# Altium project CM4-Tower.PrjPcb (part 3 of 4)

## Sheet 06_USB_Type-C_DFP.SchDoc: USB-C Connectors
size A2; Organization: Greenfield Tech Solutions; Address1: Molendreef 33; Address2: Ossendrecht; Address3: 4641CS; Address4: The Netherlands; Revision: 1.1; SheetNumber: 6; SheetTotal: 11
Used 2 times, as channels USB_Type-C_DFP_0, USB_Type-C_DFP_1. Parts and nets are listed once, with the designators drawn on the sheet.
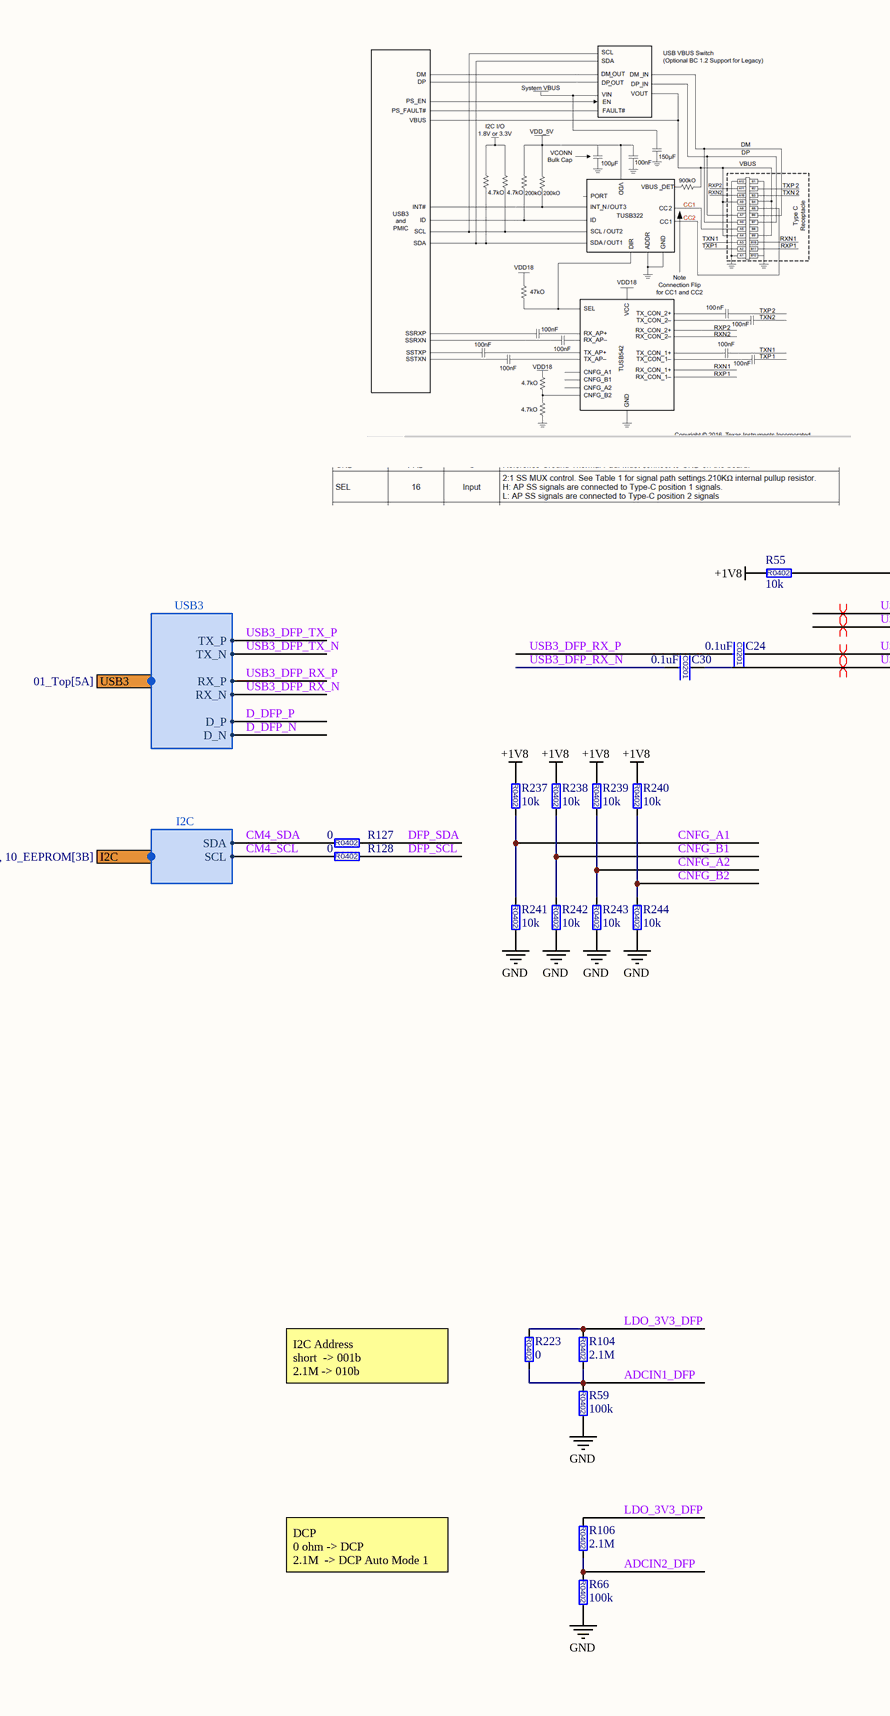
[diagram p6: 06_USB_Type-C_DFP.SchDoc, left]
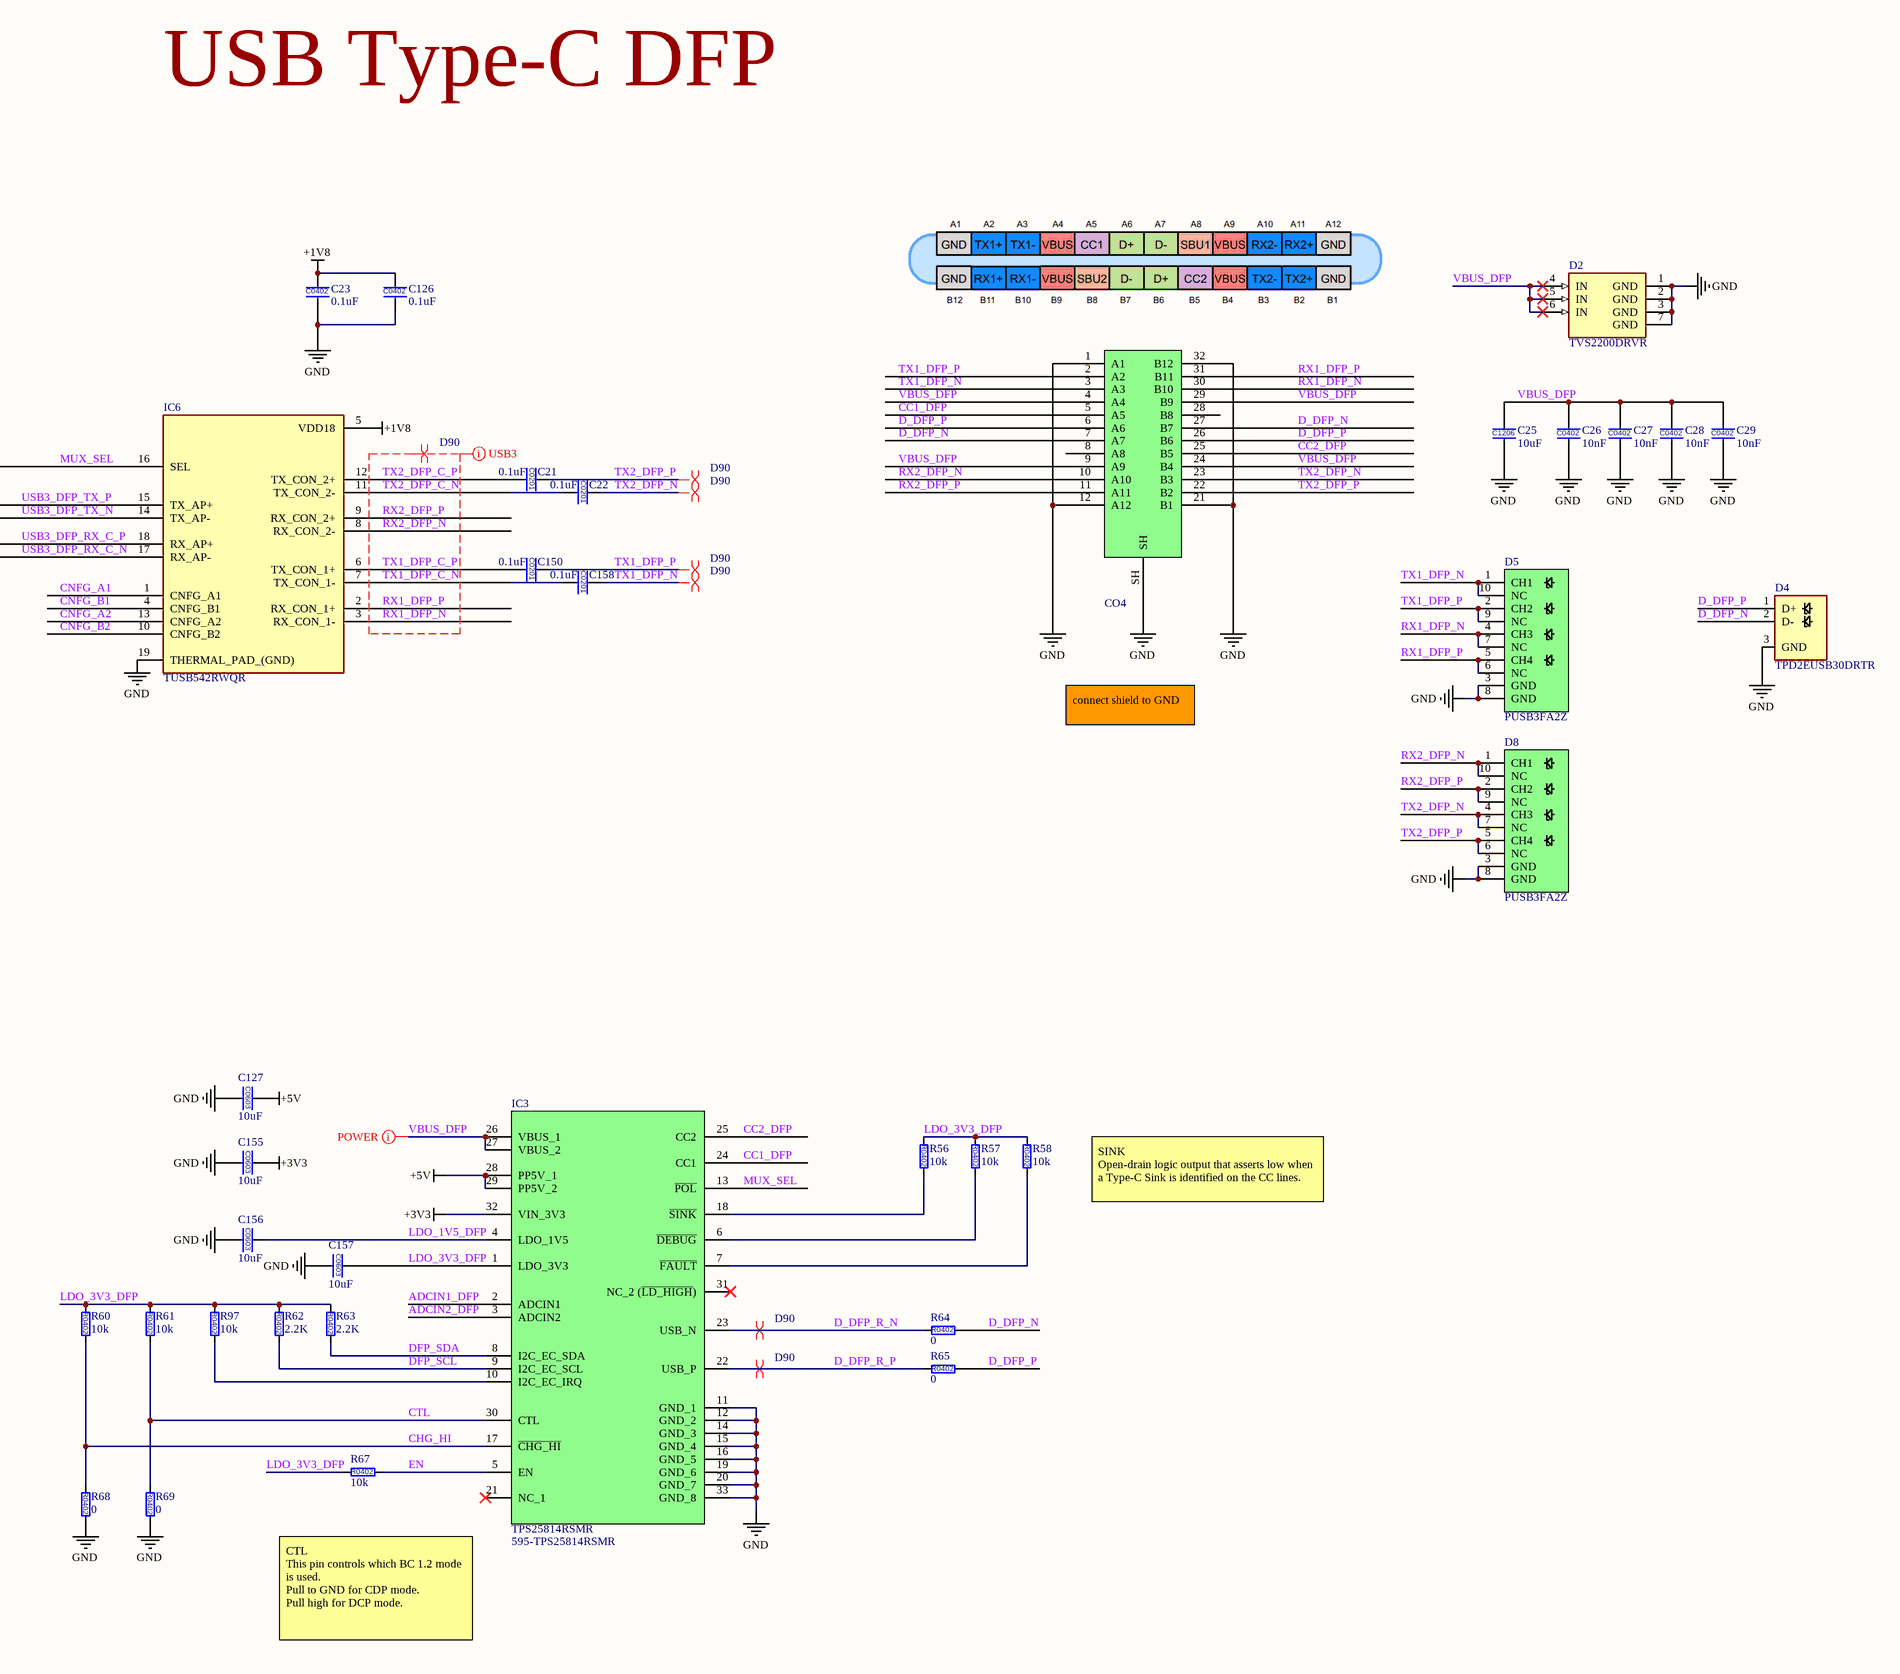
[diagram p7: 06_USB_Type-C_DFP.SchDoc, right]

### Parts
C21  0.1uF  [C0201]
C22  0.1uF  [C0201]
C23  0.1uF  [C0402]
C24  0.1uF  [C0201]
C25  10uF  [C1206]
C26  10nF  [C0402]
C27  10nF  [C0402]
C28  10nF  [C0402]
C29  10nF  [C0402]
C30  0.1uF  [C0201]
C126  0.1uF  [C0402]
C127  10uF  [C0603]
C150  0.1uF  [C0201]
C155  10uF  [C0603]
C156  10uF  [C0603]
C157  10uF  [C0603]
C158  0.1uF  [C0201]
CO4  USB4070-30-C  [USB4070-30-C]  (value not drawn)
D2  TVS2200DRVR  [TVS2200D_SON_6]
D4  TPD2EUSB30DRTR  [TPD2EUSB30DRTR_SOT-3]
D5  PUSB3FA2Z  [PUSB3FA2Z_DFN_2510_10]
D8  PUSB3FA2Z  [PUSB3FA2Z_DFN_2510_10]
IC3  TPS25814RSMR  Supplier Part Number 1: 595-TPS25814RSMR  [TPS25814RSMR_VQFN_32]
IC6  TUSB542RWQR  [TUSB542_X2QFN_18]
R55  10k  [R0402]
R56  10k  [R0402]
R57  10k  [R0402]
R58  10k  [R0402]
R59  100k  [R0402]
R60  10k  [R0402]
R61  10k  [R0402]
R62  2.2K  [R0402]
R63  2.2K  [R0402]
R64  0  [R0402]
R65  0  [R0402]
R66  100k  [R0402]
R67  10k  [R0402]
R68  0  [R0402]
R69  0  [R0402]
R97  10k  [R0402]
R104  2.1M  [R0402]
R106  2.1M  [R0402]
R127  0  [R0402]
R128  0  [R0402]
R223  0  [R0402]
R237  10k  [R0402]
R238  10k  [R0402]
R239  10k  [R0402]
R240  10k  [R0402]
R241  10k  [R0402]
R242  10k  [R0402]
R243  10k  [R0402]
R244  10k  [R0402]

### Ports
I2C (harness I2C, see 01_Top[4A], 03_RPiCM4[1B], 05_HDMI_to_DP[1B], 07_USB_Type-C_DFP_DP_ALT[1B], 08_USB_Type-C_DFP_DP_ALT_buttom[1B], 09_RTC[3B], 10_EEPROM[3B]), USB3 (harness USB3, see 01_Top[5A])

### Harnesses
USB3: TX_P, TX_N, RX_P, RX_N, D_P, D_N
I2C: SDA, SCL

### Nets
+1V8: C23.1 C126.1 IC6.5(VDD18) R55.1 R237.1 R238.1 R239.1 R240.1
+3V3: C155.1 IC3.32(VIN_3V3)
+5V: C127.1 IC3.28(PP5V_1) IC3.29(PP5V_2)
GND: C23.2 C25.2 C26.2 C27.2 C28.2 C29.2 C126.2 C127.2 C155.2 C156.2 C157.2 CO4.1(A1) CO4.12(A12) CO4.21(B1) CO4.32(B12) CO4.SH D2.1(GND) D2.2(GND) D2.3(GND) D2.7(GND) D4.3(GND) D5.3(GND) D5.8(GND) D8.3(GND) D8.8(GND) IC3.11(GND_1) IC3.12(GND_2) IC3.14(GND_3) IC3.15(GND_4) IC3.16(GND_5) IC3.19(GND_6) IC3.20(GND_7) IC3.33(GND_8) IC6.19(THERMAL_PAD_(GND)) R59.2 R66.2 R68.2 R69.2 R241.2 R242.2 R243.2 R244.2
ADCIN1_DFP: IC3.2(ADCIN1) R59.1 R104.2 R223.2
ADCIN2_DFP: IC3.3(ADCIN2) R66.1 R106.2
CC1_DFP: CO4.5(A5) IC3.24(CC1)
CC2_DFP: CO4.25(B5) IC3.25(CC2)
CHG_HI: IC3.17(~{CHG_HI}) R60.2 R68.1
CM4_SCL: R128.1 ; port I2C.SCL
CM4_SDA: R127.1 ; port I2C.SDA
CNFG_A1: IC6.1(CNFG_A1) R237.2 R241.1
CNFG_A2: IC6.13(CNFG_A2) R239.2 R243.1
CNFG_B1: IC6.4(CNFG_B1) R238.2 R242.1
CNFG_B2: IC6.10(CNFG_B2) R240.2 R244.1
CTL: IC3.30(CTL) R61.2 R69.1
D_DFP_N: CO4.7(A7) CO4.27(B7) D4.2(D-) R64.2 ; port USB3.D_N
D_DFP_P: CO4.6(A6) CO4.26(B6) D4.1(D+) R65.2 ; port USB3.D_P
D_DFP_R_N: IC3.23(USB_N) R64.1
D_DFP_R_P: IC3.22(USB_P) R65.1
DFP_SCL: IC3.9(I2C_EC_SCL) R62.2 R128.2
DFP_SDA: IC3.8(I2C_EC_SDA) R63.2 R127.2
EN: IC3.5(EN) R67.2
LDO_1V5_DFP: C156.1 IC3.4(LDO_1V5)
LDO_3V3_DFP: C157.1 IC3.1(LDO_3V3) R56.1 R57.1 R58.1 R60.1 R61.1 R62.1 R63.1 R67.1 R97.1 R104.1 R106.1 R223.1
MUX_SEL: IC3.13(~{POL}) IC6.16(SEL) R55.2
RX1_DFP_N: CO4.30(B10) D5.4(CH3) D5.7(NC) IC6.3(RX_CON_1-)
RX1_DFP_P: CO4.31(B11) D5.5(CH4) D5.6(NC) IC6.2(RX_CON_1+)
RX2_DFP_N: CO4.10(A10) D8.1(CH1) D8.10(NC) IC6.8(RX_CON_2-)
RX2_DFP_P: CO4.11(A11) D8.2(CH2) D8.9(NC) IC6.9(RX_CON_2+)
TX1_DFP_C_N: C158.2 IC6.7(TX_CON_1-)
TX1_DFP_C_P: C150.2 IC6.6(TX_CON_1+)
TX1_DFP_N: C158.1 CO4.3(A3) D5.1(CH1) D5.10(NC)
TX1_DFP_P: C150.1 CO4.2(A2) D5.2(CH2) D5.9(NC)
TX2_DFP_C_N: C22.2 IC6.11(TX_CON_2-)
TX2_DFP_C_P: C21.2 IC6.12(TX_CON_2+)
TX2_DFP_N: C22.1 CO4.23(B3) D8.4(CH3) D8.7(NC)
TX2_DFP_P: C21.1 CO4.22(B2) D8.5(CH4) D8.6(NC)
USB3_DFP_RX_C_N: C30.1 IC6.17(RX_AP-)
USB3_DFP_RX_C_P: C24.1 IC6.18(RX_AP+)
USB3_DFP_RX_N: C30.2 ; port USB3.RX_N
USB3_DFP_RX_P: C24.2 ; port USB3.RX_P
USB3_DFP_TX_N: IC6.14(TX_AP-) ; port USB3.TX_N
USB3_DFP_TX_P: IC6.15(TX_AP+) ; port USB3.TX_P
VBUS_DFP: C25.1 C26.1 C27.1 C28.1 C29.1 CO4.4(A4) CO4.9(A9) CO4.24(B4) CO4.29(B9) D2.4(IN) D2.5(IN) D2.6(IN) IC3.26(VBUS_1) IC3.27(VBUS_2)
NetIC3_6: IC3.6(~{DEBUG}) R57.2
NetIC3_7: IC3.7(~{FAULT}) R58.2
NetIC3_10: IC3.10(I2C_EC_IRQ) R97.2
NetIC3_18: IC3.18(~{SINK}) R56.2

Not connected (* = marked no-connect by the designer): CO4 8(A8) 28(B8); IC3 21(NC_1)* 31(NC_2_(~{LD_HIGH}))*

### Channels
USB_Type-C_DFP_0: designators end in .1
USB_Type-C_DFP_1: designators end in .2

### Layout directives
differential pair; differential pair class USB3: USB3_DFP_RX_C_N_USB_Type-C_DFP_0, USB3_DFP_RX_C_P_USB_Type-C_DFP_0, USB3_DFP_TX_N, USB3_DFP_TX_P
net class USB3: RX1_DFP_N, RX1_DFP_P, RX2_DFP_N, RX2_DFP_P, TX1_DFP_C_N, TX1_DFP_C_P, TX2_DFP_C_N, TX2_DFP_C_P
differential pair; differential pair class D90: D_DFP_R_N_USB_Type-C_DFP_0, D_DFP_R_P_USB_Type-C_DFP_0, RX1_DFP_N, RX1_DFP_P, RX2_DFP_N, RX2_DFP_P, TX1_DFP_C_N, TX1_DFP_C_P, TX1_DFP_N_USB_Type-C_DFP_0, TX1_DFP_P_USB_Type-C_DFP_0, TX2_DFP_C_N, TX2_DFP_C_P, TX2_DFP_N_USB_Type-C_DFP_0, TX2_DFP_P_USB_Type-C_DFP_0
net class POWER: VBUS_DFP_USB_Type-C_DFP_0

### Notes on the sheet
- USB Type-C DFP
- connect shield to GND
- SINK
  Open-drain logic output that asserts low when a Type-C Sink is identified on the CC lines.
- I2C Address
  short  -> 001b
  2.1M -> 010b
- DCP
  0 ohm -> DCP
  2.1M  -> DCP Auto Mode 1
- CTL
  This pin controls which BC 1.2 mode is used.
  Pull to GND for CDP mode.
  Pull high for DCP mode.
- Title
- Size:
- Date:
- File:
- A2
- Number:
- Time:
- Revision:
- Sheet
- of
- (in symbol 0603ZD106KAT2A) C0603
- (in symbol 02016D104KAT) C0201
- (in symbol 04023D104KAT2A) C0402
- (in symbol 04025C103JAT2A) C0402
- (in symbol 12065D106KAT4A) C1206
- (in symbol CRCW04022K20FK) R0402
- (in symbol CRCW04022M10FKED) R0402
- (in symbol CRCW040210K0FK) R0402
- (in symbol CRCW0402100KFKEDC) R0402
- (in symbol CRCW04020000Z0) R0402

### Library data of the parts
C21 C22 C24 C30 C150 C158 = 02016D104KAT: as C137 on sheet 08_USB_Type-C_DFP_DP_ALT_buttom; Category: Capacitors; Manufacturer Part Number: 02016D104KAT; Operating Temperature: -55°C ~ 85°C; Package / Case: 0201; Value: 0.1uF; Voltage - Rated: 6.3V; Supplier: Digi-Key; Tolerance: ±10%; Temperature Coefficient: X5R; Mounting Type: Surface Mount, MLCC
C23 C126 = 04023D104KAT2A: as C133 on sheet 08_USB_Type-C_DFP_DP_ALT_buttom; Manufacturer Part Number: 04023D104KAT2A; Value: 0.1uF; Voltage - Rated: 25V; Tolerance: ±10%; Temperature Coefficient: X5R
C25 = 12065D106KAT4A: CAP CER  10uF 10% 50V X5R 1206; Manufacturer: KYOCERA AVX; Value: 10µF; check: ok; Manufacturer Part Number: 12065D106KAT4A; Tolerance: ±10%; Voltage - Rated: 50V; Temperature Coefficient: X5R
C26-C29 = 04025C103JAT2A: CAP CER 10nF 5% 50V X7R 0402; Manufacturer: KYOCERA AVX; Manufacturer Part Number: 04025C103JAT2A; Operating Temperature: -55°C ~ 125°C; Package / Case: 0402 (1005 Metric); Value: 10nF; Voltage - Rated: 50V; Tolerance: ±5%; Temperature Coefficient: X7R
C127 C155-C157 = 0603ZD106KAT2A: as C151 on sheet 08_USB_Type-C_DFP_DP_ALT_buttom; Manufacturer Part Number: 0603ZD106KAT2A; Tolerance: ±10%; Voltage - Rated: 10V; Temperature Coefficient: X5R
CO4 = USB4070-30-C: 24 Position 20 VDC USB Type C Horizontal USB 3.1 Receptacle Connector; Part Number: CO0021; Manufacturer: Global Connector Technology; ID: 16; USB Standard: USB 3.1; Number of Contacts: 24; Number of Ports: 1; Mating Cycles: 10000; Shielding: Shielded; ManfactPart: USB4070-30-C; Supplier 1: Farnell; Manufacturer Part Number: USB4070-30-C; RoHS: No; Category: USB Connectors; Stock 1: 87; Pricing 1: 1=3.37000, 10=2.90000, 30=2.83000, 80=2.69000, 200=2.64000 (GBP); Mount: Surface Mount,Through Hole,Vertical; Contact Material: Copper Alloy; Contact Plating: Gold; Insulation Color: Black; Min Operating Temperature: -40°C; Max Operating Temperature: 85°C; Gender: Receptacle; Orientation: Vertical; Connector Type: USB; Series: USB4070; Packaging: Tape and Reel; Termination: Solder; Reach SVHC Compliant: Yes; Lead Free: Lead Free; Flammability Rating: UL94 V-0; ComponentLink1URL: http://www.farnell.com/datasheets/2342947.pdf?src-supplier=Farnell; ComponentLink1Description: http://www.farnell.com/datasheets/2342947.pdf?src-supplier=Farnell; ComponentLink2URL: http://www.farnell.com/cad/2113628.pdf?src-supplier=Element14; ComponentLink2Description: http://www.farnell.com/cad/2113628.pdf?src-supplier=Element14; ComponentLink3URL: http://www.farnell.com/datasheets/2342947.pdf?src-supplier=Newark; ComponentLink3Description: http://www.farnell.com/datasheets/2342947.pdf?src-supplier=Newark; RefVal: USB4070; Supplier Part Number 1: 2784985
D2 = TVS2200DRVR: 22-V flat-clamp surge protection device 6-WSON -40 to 125; Manufacturer: Texas Instruments; Reverse Standoff Voltage: 22V; Standoff Height: 0mm; Clamping Voltage: 27.7V; Number Of Channels: 1; Capacitance: 105pF; Value: 105pF; Direction: Unidirectional; Breakdown Voltage: 24.6V; Peak Pulse Current: 40A; Package: DRV0006A; Category: Diode; Device Class L3: unset; Device Class L1: Circuit Protection; Temperature: -40°C to +125°C; ComponentLink2Description: Datasheet; Height: 0.8mm; Ambient Temperature Range Low: -40°C; Octopart: https://octopart.com/tvs2200drvr-texas+instruments-88217346; Temperature Range High: +125°C; Automotive: No; Temperature Range Low: -40°C; Ipc Land Pattern Name: DFN200X200X75-6; Manufacturer Part Number: TVS2200DRVR; Device Class L2: ESD and Circuit Protection ICs; RoHS: TRUE; Lead Free: Yes; Ambient Temperature Range High: +125°C; Mouser Description: Diode TVS Single Uni-Dir 22V 1.12KW 6-Pin WSON EP T/R; ComponentLink2URL: http://www.ti.com/lit/ds/symlink/tvs2200.pdf; Digikey Description: UNIDIR PRECISION SURGE DIODE; Supplier 1: Mouser; Pricing 1: 1=0.56000, 10=0.47800, 50=0.44600, 100=0.35700, 1000=0.21700, 10000=0.19700 (USD); Mount: Surface Mount; Min Operating Temperature: -40°C; Max Operating Temperature: 125°C; Packaging: Tape and Reel; Number of Circuits: 1; RoHS Compliant: Yes; ComponentLink1URL: http://www.ti.com/lit/ds/symlink/tvs2200.pdf?src-supplier=Digi-Key; ComponentLink1Description: http://www.ti.com/lit/ds/symlink/tvs2200.pdf?src-supplier=Digi-Key; ComponentLink3URL: http://www.ti.com/general/docs/suppproductinfo.tsp?distId=10&amp;gotoUrl=http%3A%2F%2Fwww.ti.com%2Flit%2Fgpn%2Ftvs2200&src-supplier=Digi-Key; ComponentLink3Description: http://www.ti.com/general/docs/suppproductinfo.tsp?distId=10&amp;gotoUrl=http%3A%2F%2Fwww.ti.com%2Flit%2Fgpn%2Ftvs2200&src-supplier=Digi-Key; Supplier Part Number 1: 595-TVS2200DRVR
D4 = TPD2EUSB30DRTR: Dual 0.7-pF, 5.5-V ±8-kV ESD protection diode with 5-A surge rating for USB 3.0 3-SOT-9X3 -40 to 85; Manufacturer: Texas Instruments; Direction: Bidirectional,Unidirectional; Capacitance: 0.8pF; Number of Bidirectional Channels: 2; Reverse Standoff Voltage: 5.5V; Min Breakdown Voltage: 9V; Clamping Voltage: 8V; Peak Pulse Power: 45W; Power Line Protection: Yes; Test Current: 1mA; Peak Pulse Current: 1A; Supplier 1: Mouser; Manufacturer Part Number: TPD2EUSB30DRTR; RoHS: Yes; Category: Integrated Circuits (ICs); Pricing 1: 1=0.66000, 10=0.56100, 50=0.56000, 100=0.41900, 1000=0.25500, 10000=0.23100 (USD); Case/Package: SOT; Number of Pins: 3; Min Operating Temperature: -40°C; Max Operating Temperature: 85°C; Packaging: Tape and Reel; Package Quantity: 1; Breakdown Voltage: 9V; Number of Channels: 2; Working Voltage: 5.5V; ESD Protection: Yes; Element Configuration: Dual; Interface: USB; Series: -; Number of Unidirectional Channels: 2; Length: 1mm; Width: 0.85mm; Height: 0.45mm; Depth: 0.8mm; Radiation Hardening: No; Reach SVHC Compliant: Yes; Lead Free: Lead Free; RoHS Compliant: Yes; ComponentLink1URL: https://datasheet.ciiva.com/1611/tpd2eusb30-1611602.pdf?src-supplier=Newark; ComponentLink1Description: https://datasheet.ciiva.com/1611/tpd2eusb30-1611602.pdf?src-supplier=Newark; ComponentLink2URL: https://datasheet.ciiva.com/15134/getdatasheetpartid-202713-15134479.pdf?src-supplier=Verical; ComponentLink2Description: https://datasheet.ciiva.com/15134/getdatasheetpartid-202713-15134479.pdf?src-supplier=Verical; ComponentLink3URL: https://datasheet.ciiva.com/1504/1882087-1504248.pdf?src-supplier=Element14; ComponentLink3Description: https://datasheet.ciiva.com/1504/1882087-1504248.pdf?src-supplier=Element14; ComponentLink4URL: https://datasheet.ciiva.com/353/tpd2eusb30-353273.pdf?src-supplier=Digi-Key; ComponentLink4Description: https://datasheet.ciiva.com/353/tpd2eusb30-353273.pdf?src-supplier=Digi-Key; ComponentLink5URL: https://datasheet.ciiva.com/353/tpd2eusb30-353272.pdf?src-supplier=Digi-Key; ComponentLink5Description: https://datasheet.ciiva.com/353/tpd2eusb30-353272.pdf?src-supplier=Digi-Key; ComponentLink6URL: https://datasheet.ciiva.com/353/tpd2eusb30-353274.pdf?src-supplier=Digi-Key; ComponentLink6Description: https://datasheet.ciiva.com/353/tpd2eusb30-353274.pdf?src-supplier=Digi-Key; Supplier Part Number 1: 595-TPD2EUSB30DRTR
D5 D8 = PUSB3FA2Z: PUSB3FA2/SOT1176/XSON10; Part Number: DI0007; Manufacturer: Nexperia; ID: 7; RefVal: TVS; ManfactPart: PUSB3FA2Z; Supplier 1: Digi-Key; Manufacturer Part Number: PUSB3FA2Z; RoHS: No; Category: TVS Diodes; Stock 1: 8565; Pricing 1: 1=0.39000, 10=0.31700, 100=0.21570, 500=0.16178, 1000=0.12134, 2000=0.11123 (USD); ComponentLink1URL: http://www.farnell.com/datasheets/2621625.pdf?src-supplier=Farnell; ComponentLink1Description: http://www.farnell.com/datasheets/2621625.pdf?src-supplier=Farnell; ComponentLink2URL: https://assets.nexperia.com/documents/data-sheet/PUSB3FA2.pdf?src-supplier=Digi-Key; ComponentLink2Description: https://assets.nexperia.com/documents/data-sheet/PUSB3FA2.pdf?src-supplier=Digi-Key; ComponentLink3URL: http://www.farnell.com/datasheets/2621625.pdf?src-supplier=Newark; ComponentLink3Description: http://www.farnell.com/datasheets/2621625.pdf?src-supplier=Newark; Supplier Part Number 1: 1727-7813-1-ND; Supplier 2: Farnell; Stock 2: 8440; Pricing 2: 5=0.31600, 10=0.25800, 100=0.17600, 500=0.13300, 1000=0.11400, 5000=0.09420 (GBP); Supplier 3: Digi-Key; Stock 3: 5000; Pricing 3: 5000=0.10449, 10000=0.09774, 25000=0.09450 (USD); Supplier Part Number 3: 1727-7813-2-ND; Supplier Part Number 2: 2901054
IC3 = TPS25814RSMR: USB Type-C® controller with integrated source power switch 32-VQFN -40 to 105; Manufacturer_Name: Texas Instruments; Datasheet Link: https://www.ti.com/lit/ds/symlink/tps25814.pdf?ts=1614246005864&ref_url=https%253A%252F%252Fwww.mouser.it%252F; Height: 1mm; Manufacturer_Part_Number: TPS25814RSMR; Mouser Part Number: 595-TPS25814RSMR; Mouser Price/Stock: https://www.mouser.co.uk/ProductDetail/Texas-Instruments/TPS25814RSMR?qs=eP2BKZSCXI7b%2F2SE6IEFzg%3D%3D; Supplier 1: Mouser; Manufacturer: Texas Instruments; Manufacturer Part Number: TPS25814RSMR; RoHS: No; Category: Integrated Circuits (ICs); Pricing 1: 1=2.50000, 10=2.25000, 50=2.12000, 100=1.81000, 1000=1.24000, 10000=1.23000 (USD)
IC6 = TUSB542RWQR: Integrated Circuit; Manufacturer_Name: Texas Instruments; Datasheet Link: http://www.ti.com/lit/ds/symlink/tusb542.pdf; Manufacturer_Part_Number: TUSB542RWQR; Mouser Part Number: 595-TUSB542RWQR; Mouser Price/Stock: https://www.mouser.co.uk/ProductDetail/Texas-Instruments/TUSB542RWQR?qs=n%252BTO0c4TDSbKMyA4z73fLg%3D%3D; Arrow Part Number: TUSB542RWQR; Arrow Price/Stock: https://www.arrow.com/en/products/tusb542rwqr/texas-instruments
R55-R58 R60 R61 R67 R97 R237-R244 = CRCW040210K0FK: as R172 on sheet 08_USB_Type-C_DFP_DP_ALT_buttom; Manufacturer Part Number: CRCW040210K0FK; Value: 10K; Power (Watts): 1/16W; Package / Case: 0402; Tolerance: ±1%
R59 R66 = CRCW0402100KFKEDC: RES SMD 100K ohm 1% 1/16W R0402; Manufacturer: Vishay; check: ok; Manufacturer Part Number: CRCW0402100KFKEDC; Value: 100K; Power (Watts): 1/16W; Package / Case: 0402; Tolerance: ±1%
R62 R63 = CRCW04022K20FK: RES SMD 2.2K ohm 1% 1/16W R0402; Manufacturer: Vishay; check: ok; Manufacturer Part Number: CRCW04022K20FK; Value: 2.2K; Power (Watts): 1/16W; Package / Case: 0402; Tolerance: ±1%
R64 R65 R68 R69 R223 = CRCW04020000Z0: as R150 on sheet 08_USB_Type-C_DFP_DP_ALT_buttom; Manufacturer Part Number: CRCW04020000Z0; Value: 0; Power (Watts): 1/16W; Package / Case: 0402
R104 R106 = CRCW04022M10FKED: RES SMD 2.1M ohm 1% 1/16W R0402; Manufacturer: Vishay; check: ok; Manufacturer Part Number: CRCW04022M10FKED; Value: 2.1M; Power (Watts): 1/16W; Package / Case: 0402; Tolerance: ±1%
R127 R128 = CRCW04020000Z0: RES SMD 0 ohm 1/16W R0402; Manufacturer: Vishay Dale; check: ok; Manufacturer Part Number: CRCW04020000Z0; Value: 0; Power (Watts): 1/16W; Package / Case: 0402

## Sheet 04_PCIe_VL805.SchDoc: PCI-e to USB3 Hub
size A2; Organization: Greenfield Tech Solutions; Address1: Molendreef 33; Address2: Ossendrecht; Address3: 4641CS; Address4: The Netherlands; Revision: 1.1; SheetNumber: 4; SheetTotal: 11
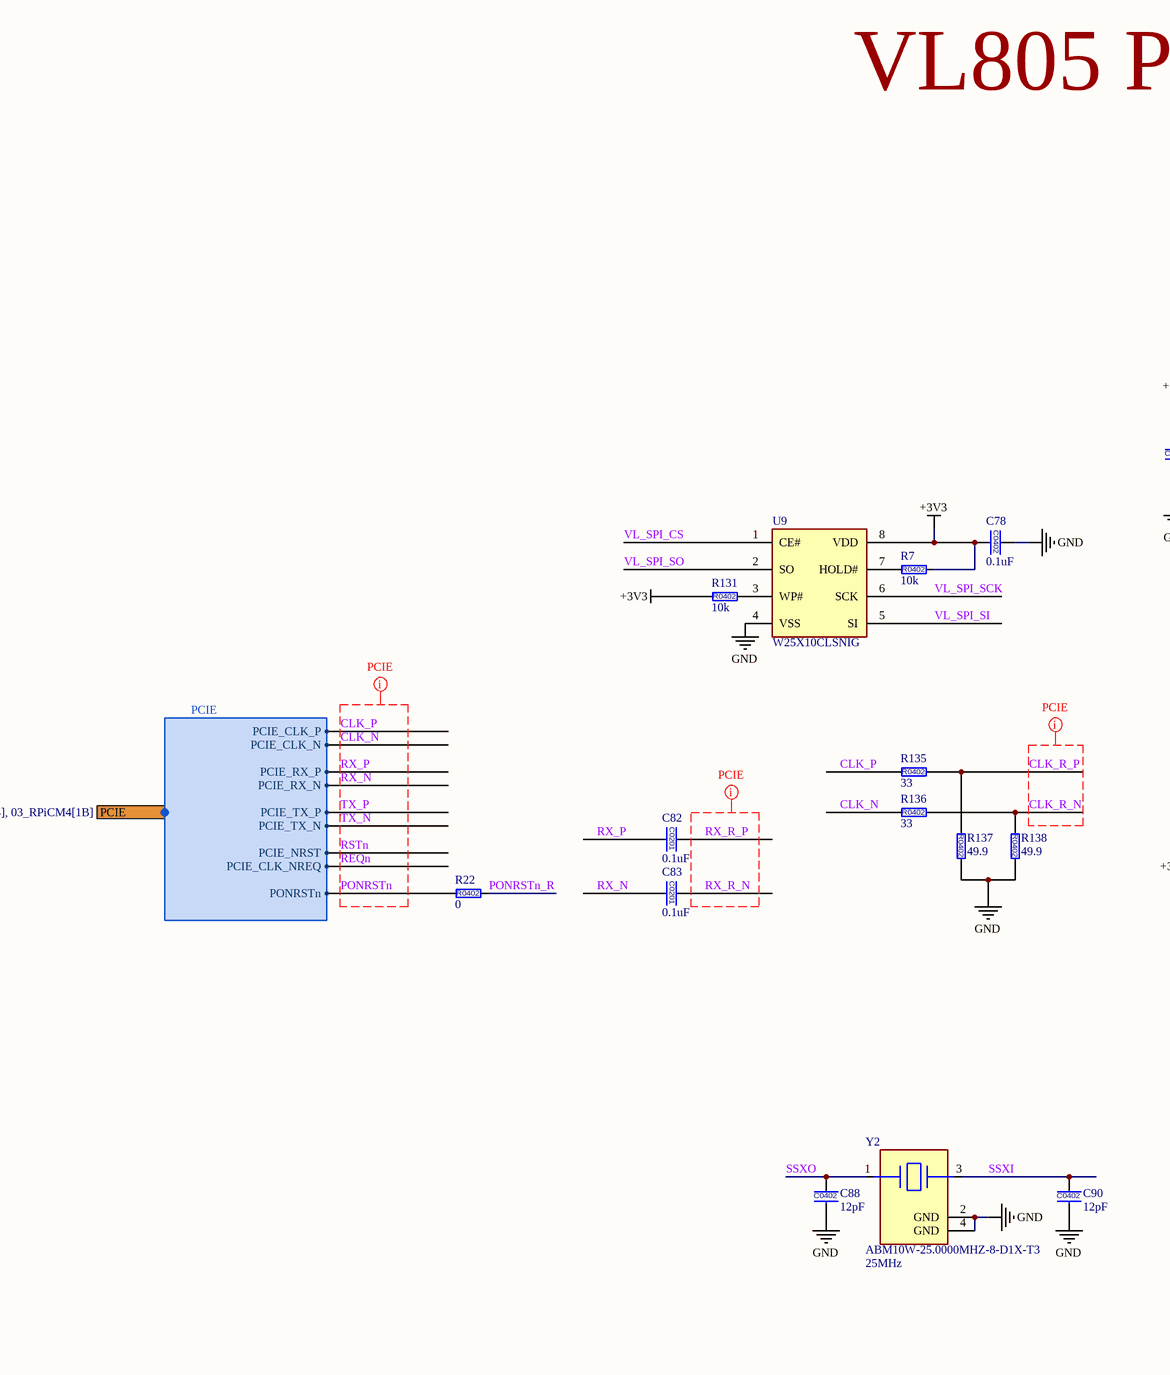
[diagram p8: 04_PCIe_VL805.SchDoc, left]
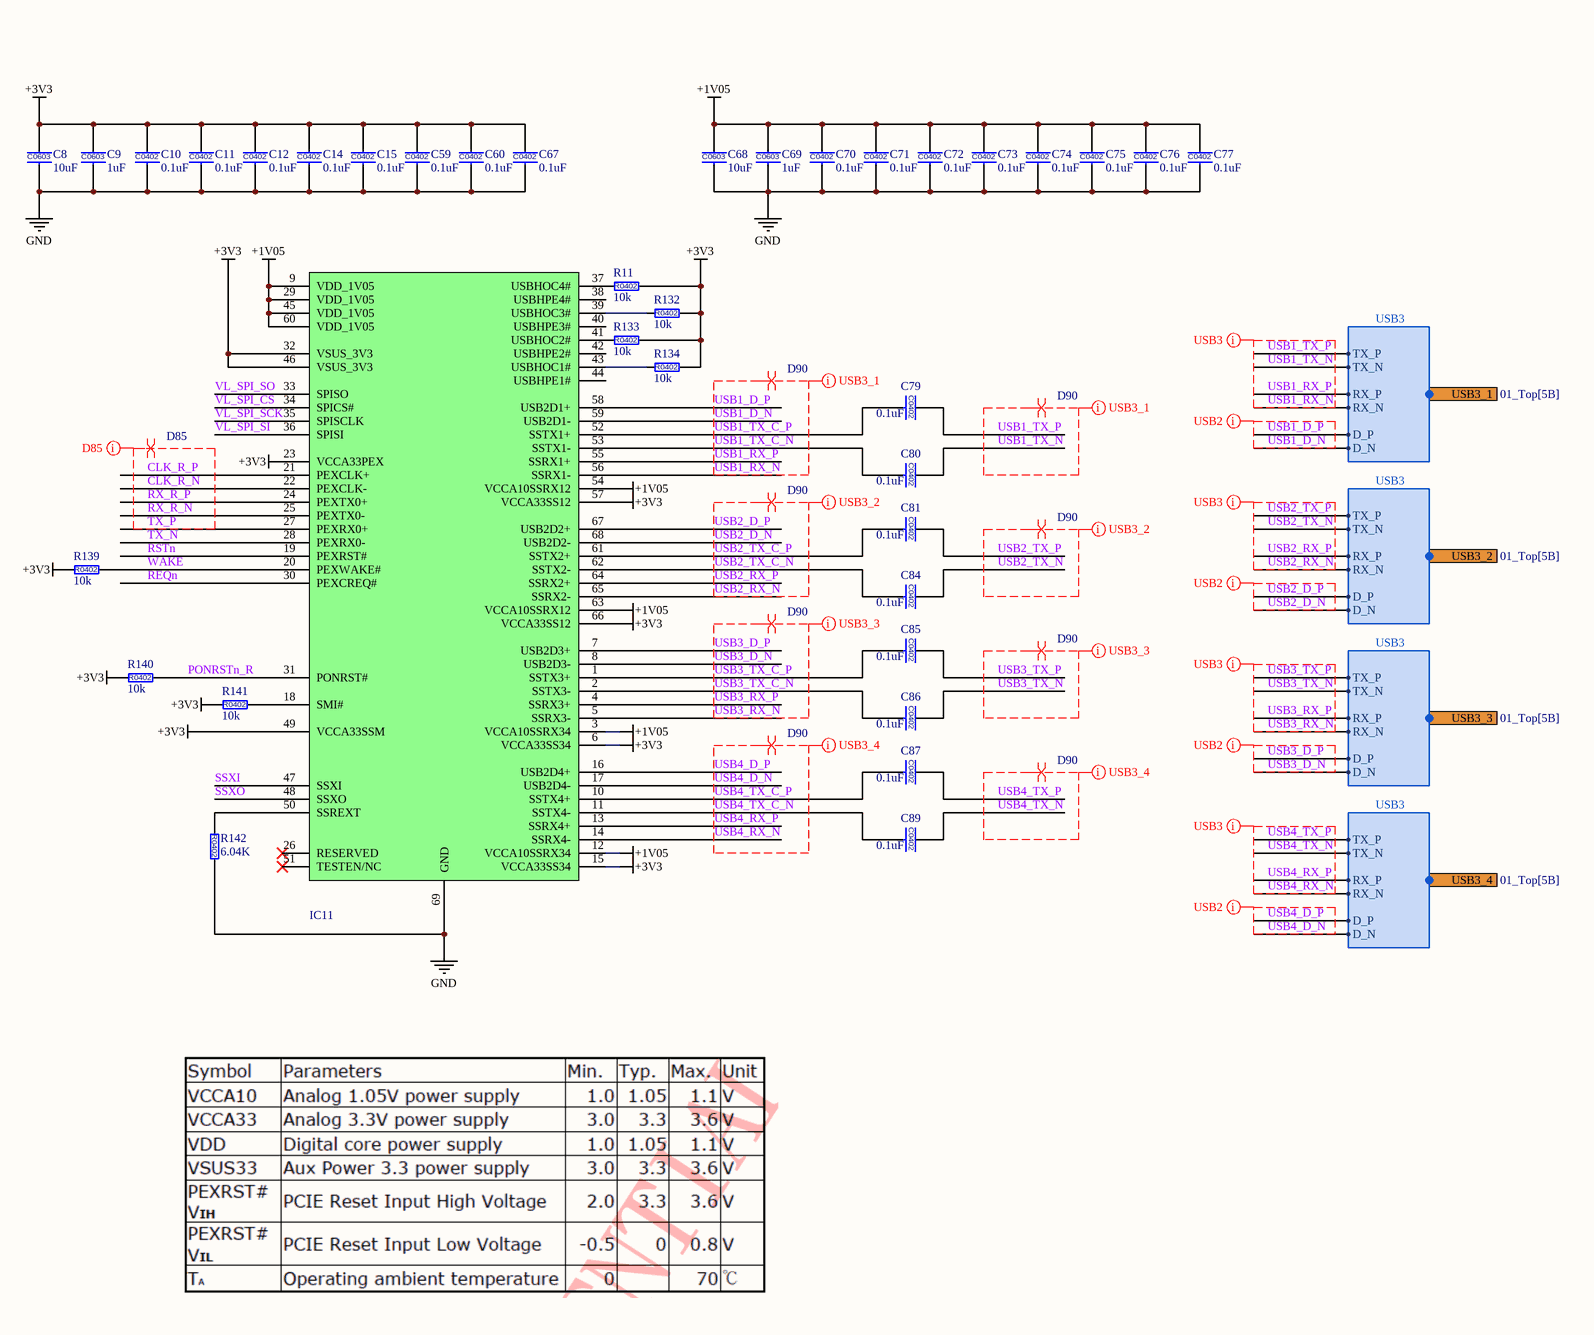
[diagram p9: 04_PCIe_VL805.SchDoc, right]

### Parts
C8  10uF  [C0603]
C9  1uF  [C0603]
C10  0.1uF  [C0402]
C11  0.1uF  [C0402]
C12  0.1uF  [C0402]
C14  0.1uF  [C0402]
C15  0.1uF  [C0402]
C59  0.1uF  [C0402]
C60  0.1uF  [C0402]
C67  0.1uF  [C0402]
C68  10uF  [C0603]
C69  1uF  [C0603]
C70  0.1uF  [C0402]
C71  0.1uF  [C0402]
C72  0.1uF  [C0402]
C73  0.1uF  [C0402]
C74  0.1uF  [C0402]
C75  0.1uF  [C0402]
C76  0.1uF  [C0402]
C77  0.1uF  [C0402]
C78  0.1uF  [C0402]
C79  0.1uF  [C0402]
C80  0.1uF  [C0402]
C81  0.1uF  [C0402]
C82  0.1uF  [C0201]
C83  0.1uF  [C0201]
C84  0.1uF  [C0402]
C85  0.1uF  [C0402]
C86  0.1uF  [C0402]
C87  0.1uF  [C0402]
C88  12pF  [C0402]
C89  0.1uF  [C0402]
C90  12pF  [C0402]
IC11  VL805-Q6  [VL805-Q6_QFN-68G]  (value not drawn)
R7  10k  [R0402]
R11  10k  [R0402]
R22  0  [R0402]
R131  10k  [R0402]
R132  10k  [R0402]
R133  10k  [R0402]
R134  10k  [R0402]
R135  33  [R0402]
R136  33  [R0402]
R137  49.9  [R0402]
R138  49.9  [R0402]
R139  10k  [R0402]
R140  10k  [R0402]
R141  10k  [R0402]
R142  6.04K  [R0402]
U9  W25X10CLSNIG  [W25X10CLSNIG_SOIC_8]
Y2  ABM10W-25.0000MHZ-8-D1X-T3  Frequency: 25MHz  [ABM10W]

### Ports
PCIE (harness PCIE, see 01_Top[5B], 03_RPiCM4[1B]), USB3_1 (harness USB3, see 01_Top[5B]), USB3_2 (harness USB3, see 01_Top[5B]), USB3_3 (harness USB3, see 01_Top[5B]), USB3_4 (harness USB3, see 01_Top[5B])

### Harnesses
PCIE: PCIE_CLK_NREQ, PCIE_CLK_P, PCIE_CLK_N, PCIE_NRST, PCIE_RX_P, PCIE_TX_P, PCIE_RX_N, PCIE_TX_N, PONRSTn
USB3: TX_P, TX_N, RX_P, RX_N, D_P, D_N

### Nets
+1V05: C68.1 C69.1 C70.1 C71.1 C72.1 C73.1 C74.1 C75.1 C76.1 C77.1 IC11.3(VCCA10SSRX34) IC11.9(VDD_1V05) IC11.12(VCCA10SSRX34) IC11.29(VDD_1V05) IC11.45(VDD_1V05) IC11.54(VCCA10SSRX12) IC11.60(VDD_1V05) IC11.63(VCCA10SSRX12)
+3V3: C8.1 C9.1 C10.1 C11.1 C12.1 C14.1 C15.1 C59.1 C60.1 C67.1 C78.2 IC11.6(VCCA33SS34) IC11.15(VCCA33SS34) IC11.23(VCCA33PEX) IC11.32(VSUS_3V3) IC11.46(VSUS_3V3) IC11.49(VCCA33SSM) IC11.57(VCCA33SS12) IC11.66(VCCA33SS12) R7.2 R11.2 R131.1 R132.2 R133.2 R134.2 R139.1 R140.1 R141.1 U9.8(VDD)
GND: C8.2 C9.2 C10.2 C11.2 C12.2 C14.2 C15.2 C59.2 C60.2 C67.2 C68.2 C69.2 C70.2 C71.2 C72.2 C73.2 C74.2 C75.2 C76.2 C77.2 C78.1 C88.2 C90.2 IC11.69(GND) R137.2 R138.2 R142.2 U9.4(VSS) Y2.2(GND) Y2.4(GND)
CLK_N: R136.1 ; port PCIE.PCIE_CLK_N
CLK_P: R135.1 ; port PCIE.PCIE_CLK_P
CLK_R_N: IC11.22(PEXCLK-) R136.2 R138.1
CLK_R_P: IC11.21(PEXCLK+) R135.2 R137.1
PONRSTn: R22.1 ; port PCIE.PONRSTn  [project net CM4_rstn]
PONRSTn_R: IC11.31(PONRST#) R22.2 R140.2
REQn: IC11.30(PEXCREQ#) ; port PCIE.PCIE_CLK_NREQ  [project net PCIE_CLK_NREQ]
RSTn: IC11.19(PEXRST#) ; port PCIE.PCIE_NRST  [project net PCIe_NRST]
RX_N: C83.2 ; port PCIE.PCIE_RX_N  [project net PCIE_RX_N]
RX_P: C82.2 ; port PCIE.PCIE_RX_P  [project net PCIE_RX_P]
RX_R_N: C83.1 IC11.25(PEXTX0-)
RX_R_P: C82.1 IC11.24(PEXTX0+)
SSXI: C90.1 IC11.47(SSXI) Y2.3
SSXO: C88.1 IC11.48(SSXO) Y2.1
TX_N: IC11.28(PEXRX0-) ; port PCIE.PCIE_TX_N  [project net PCIE_TX_N]
TX_P: IC11.27(PEXRX0+) ; port PCIE.PCIE_TX_P  [project net PCIE_TX_P]
USB1_D_N: IC11.59(USB2D1-) ; port USB3_1.D_N  [project net D_N]
USB1_D_P: IC11.58(USB2D1+) ; port USB3_1.D_P  [project net D_P]
USB1_RX_N: IC11.56(SSRX1-) ; port USB3_1.RX_N
USB1_RX_P: IC11.55(SSRX1+) ; port USB3_1.RX_P
USB1_TX_C_N: C80.2 IC11.53(SSTX1-)
USB1_TX_C_P: C79.2 IC11.52(SSTX1+)
USB1_TX_N: C80.1 ; port USB3_1.TX_N
USB1_TX_P: C79.1 ; port USB3_1.TX_P
USB2_D_N: IC11.68(USB2D2-) ; port USB3_2.D_N  [project net DP_D_N]
USB2_D_P: IC11.67(USB2D2+) ; port USB3_2.D_P  [project net DP_D_P]
USB2_RX_N: IC11.65(SSRX2-) ; port USB3_2.RX_N  [project net DP_USB3_RX_N]
USB2_RX_P: IC11.64(SSRX2+) ; port USB3_2.RX_P  [project net DP_USB3_RX_P]
USB2_TX_C_N: C84.2 IC11.62(SSTX2-)
USB2_TX_C_P: C81.2 IC11.61(SSTX2+)
USB2_TX_N: C84.1 ; port USB3_2.TX_N  [project net DP_USB3_TX_N]
USB2_TX_P: C81.1 ; port USB3_2.TX_P  [project net DP_USB3_TX_P]
USB3_D_N: IC11.8(USB2D3-) ; port USB3_3.D_N  [project net D_DFP_N]
USB3_D_P: IC11.7(USB2D3+) ; port USB3_3.D_P  [project net D_DFP_P]
USB3_RX_N: IC11.5(SSRX3-) ; port USB3_3.RX_N  [project net USB3_DFP_RX_N]
USB3_RX_P: IC11.4(SSRX3+) ; port USB3_3.RX_P  [project net USB3_DFP_RX_P]
USB3_TX_C_N: C86.2 IC11.2(SSTX3-)
USB3_TX_C_P: C85.2 IC11.1(SSTX3+)
USB3_TX_N: C86.1 ; port USB3_3.TX_N  [project net USB3_DFP_TX_N]
USB3_TX_P: C85.1 ; port USB3_3.TX_P  [project net USB3_DFP_TX_P]
USB4_D_N: IC11.17(USB2D4-) ; port USB3_4.D_N  [project net D_DFP_N]
USB4_D_P: IC11.16(USB2D4+) ; port USB3_4.D_P  [project net D_DFP_P]
USB4_RX_N: IC11.14(SSRX4-) ; port USB3_4.RX_N  [project net USB3_DFP_RX_N]
USB4_RX_P: IC11.13(SSRX4+) ; port USB3_4.RX_P  [project net USB3_DFP_RX_P]
USB4_TX_C_N: C89.2 IC11.11(SSTX4-)
USB4_TX_C_P: C87.2 IC11.10(SSTX4+)
USB4_TX_N: C89.1 ; port USB3_4.TX_N  [project net USB3_DFP_TX_N]
USB4_TX_P: C87.1 ; port USB3_4.TX_P  [project net USB3_DFP_TX_P]
VL_SPI_CS: IC11.34(SPICS#) U9.1(CE#)
VL_SPI_SCK: IC11.35(SPISCLK) U9.6(SCK)
VL_SPI_SI: IC11.36(SPISI) U9.5(SI)
VL_SPI_SO: IC11.33(SPISO) U9.2(SO)
WAKE: IC11.20(PEXWAKE#) R139.2
NetIC11_18: IC11.18(SMI#) R141.2
NetIC11_37: IC11.37(USBHOC4#) R11.1
NetIC11_39: IC11.39(USBHOC3#) R132.1
NetIC11_41: IC11.41(USBHOC2#) R133.1
NetIC11_43: IC11.43(USBHOC1#) R134.1
NetIC11_50: IC11.50(SSREXT) R142.1
NetR7_1: R7.1 U9.7(HOLD#)
NetR131_2: R131.2 U9.3(WP#)

Not connected (* = marked no-connect by the designer): IC11 26(RESERVED)* 38(USBHPE4#) 40(USBHPE3#) 42(USBHPE2#) 44(USBHPE1#) 51(TESTEN/NC)*

### Layout directives
net class PCIE: CLK_N, CLK_P, CLK_R_N, CLK_R_P, PONRSTn, REQn, RSTn, RX_N, RX_P, RX_R_N, RX_R_P, TX_N, TX_P
differential pair; differential pair class D85: CLK_R_N, CLK_R_P, RX_R_N, RX_R_P, TX_P
net class D85: CLK_R_N, CLK_R_P, RX_R_N, RX_R_P, TX_P
net class USB3_1: USB1_D_N, USB1_D_P, USB1_RX_N, USB1_RX_P, USB1_TX_C_N, USB1_TX_C_P, USB1_TX_N, USB1_TX_P
net class USB3_2: USB2_D_N, USB2_D_P, USB2_RX_N, USB2_RX_P, USB2_TX_C_N, USB2_TX_C_P, USB2_TX_N, USB2_TX_P
net class USB3_3: USB3_D_N, USB3_D_P, USB3_RX_N, USB3_RX_P, USB3_TX_C_N, USB3_TX_C_P, USB3_TX_N, USB3_TX_P
net class USB3_4: USB4_D_N, USB4_D_P, USB4_RX_N, USB4_RX_P, USB4_TX_C_N, USB4_TX_C_P, USB4_TX_N, USB4_TX_P
differential pair; differential pair class D90: USB1_D_N, USB1_D_P, USB1_RX_N, USB1_RX_P, USB1_TX_C_N, USB1_TX_C_P, USB1_TX_N, USB1_TX_P, USB2_D_N, USB2_D_P, USB2_RX_N, USB2_RX_P, USB2_TX_C_N, USB2_TX_C_P, USB2_TX_N, USB2_TX_P, USB3_D_N, USB3_D_P, USB3_RX_N, USB3_RX_P, USB3_TX_C_N, USB3_TX_C_P, USB3_TX_N, USB3_TX_P, USB4_D_N, USB4_D_P, USB4_RX_N, USB4_RX_P, USB4_TX_C_N, USB4_TX_C_P, USB4_TX_N, USB4_TX_P
net class USB3: USB1_RX_N, USB1_RX_P, USB1_TX_N, USB1_TX_P, USB2_RX_N, USB2_RX_P, USB2_TX_N, USB2_TX_P, USB3_RX_N, USB3_RX_P, USB3_TX_N, USB3_TX_P, USB4_RX_N, USB4_RX_P, USB4_TX_N, USB4_TX_P
net class USB2: USB1_D_N, USB1_D_P, USB2_D_N, USB2_D_P, USB3_D_N, USB3_D_P, USB4_D_N, USB4_D_P

### Notes on the sheet
- VL805 PCIe USB3 Controller
- Title
- Size:
- Date:
- File:
- A2
- Number:
- Time:
- Revision:
- Sheet
- of
- (in symbol 0201ZD105MAT2A) C0603
- (in symbol 0603ZD106KAT2A) C0603
- (in symbol 02016D104KAT) C0201
- (in symbol 04023A120KAT2A) C0402
- (in symbol 04023D104KAT2A) C0402
- (in symbol CRCW04026K04FKEDC) R0402
- (in symbol CRCW040210K0FK) R0402
- (in symbol CRCW040233R0FKEDC) R0402
- (in symbol CRCW040249R9FKEDC) R0402
- (in symbol CRCW04020000Z0) R0402

### Library data of the parts
C8 C68 = 0603ZD106KAT2A: CAP CER 10uF 10% 10V X5R 0603; Manufacturer: KYOCERA AVX; Value: 10µF; Manufacturer Part Number: 0603ZD106KAT2A; Tolerance: ±10%; Voltage - Rated: 10V; Temperature Coefficient: X5R
C9 C69 = 0201ZD105MAT2A: CAP CER 1uF 20% 10V X5R 0603; Manufacturer: KYOCERA AVX; Value: 1uF; Tolerance: 20%; Manufacturer Part Number: 0201ZD105MAT2A
C10-C12 C14 C15 C59 C60 C67 C70-C81 C84-C87 C89 = 04023D104KAT2A: CAP CER  0.1uF 10% 25V X5R 0402; Manufacturer: AVX Corporation; Manufacturer Part Number: 04023D104KAT2A; Value: 0.1uF; Voltage - Rated: 25V; Tolerance: ±10%; Temperature Coefficient: X5R
C82 C83 = 02016D104KAT: CAP CER  0.1uF 10% 6.3V X5R 0201; Manufacturer: AVX Corporation; Capacitance: 100nF; Category: Capacitors; Manufacturer Part Number: 02016D104KAT; Operating Temperature: -55°C ~ 85°C; Package / Case: 0201; Value: 0.1uF; Voltage - Rated: 6.3V; Supplier: Digi-Key; Tolerance: ±10%; Temperature Coefficient: X5R; Mounting Type: Surface Mount, MLCC
C88 C90 = 04023A120KAT2A: CAP CER 12pF 10% 25V NP0 0402; Manufacturer: KYOCERA AVX; Capacitance: 1uF; Manufacturer Part Number: 04023A120KAT2A; Operating Temperature: -55°C ~ 85°C; Package / Case: 0402 (1005 Metric); Value: 12pF; Voltage - Rated: 25V; Tolerance: ±10%; Temperature Coefficient: NP0
IC11 = VL805-Q6: VL805 4-Port USB 3.0 Host Controller; Manufacturer: VLI; ID: 46; Manufacturer Part Number: VL805-Q6
R7 R131 = CRCW040210K0FK: RES SMD 10K ohm 1% 1/16W R0402; Manufacturer: Vishay Dale; Manufacturer Part Number: CRCW040210K0FK; Value: 10K; Power (Watts): 1/16W; Package / Case: 0402; Tolerance: ±1%
R11 R132-R134 R139-R141 = CRCW040210K0FK: RES SMD 10K ohm 1% 1/16W R0402; Manufacturer: Vishay; check: ok; Manufacturer Part Number: CRCW040210K0FK; Value: 10K; Power (Watts): 1/16W; Package / Case: 0402; Tolerance: ±1%
R22 = CRCW04020000Z0: RES SMD 0 ohm 1/16W R0402; Manufacturer: Vishay Dale; Manufacturer Part Number: CRCW04020000Z0; Value: 0; Power (Watts): 1/16W; Package / Case: 0402
R135 R136 = CRCW040233R0FKEDC: RES SMD 33 ohm 1% 1/16W R0402; Manufacturer: Vishay; check: ok; Manufacturer Part Number: CRCW040233R0FKEDC; Value: 33; Power (Watts): 1/16W; Package / Case: 0402; Tolerance: ±1%
R137 R138 = CRCW040249R9FKEDC: RES SMD 49.9 ohm 1% 1/16W R0402; Manufacturer: Vishay; check: ok; Manufacturer Part Number: CRCW040249R9FKEDC; Value: 49.9; Power (Watts): 1/16W; Package / Case: 0402; Tolerance: ±1%
R142 = CRCW04026K04FKEDC: RES SMD6.04K ohm 1% 1/16W R0402; Manufacturer: Vishay; Manufacturer Part Number: CRCW04026K04FKEDC; Value: 6.04K; Power (Watts): 1/16W; Package / Case: 0402; Tolerance: ±1%
U9 = W25X10CLSNIG: IC FLASH 1MBIT 104MHZ 8SOIC; Manufacturer: Winbond; Interface: SPI,Serial; Memory Format: FLASH,NOR; Access Time: 8ns; Address Bus Width: 24b; Density: 1Mb; Max Supply Voltage: 3.6V; Min Supply Voltage: 2.3V; Page Size: 256B; Memory Size: 128000; Nominal Supply Current: 14mA; Sync/Async: Synchronous; Supplier 1: Digi-Key; Manufacturer Part Number: W25X10CLSNIG; RoHS: Yes; Category: Flash; Mounting Technology: Surface Mount; Case/Package: SOIC; Pins: 8; Min Operating Temperature: -40°C; Max Operating Temperature: 85°C; Packaging: Rail/Tube; Frequency: 104MHz; Package Quantity: 100; Series: SpiFlash®; Access Time-Max: 8ns; Supply Current: 14mA; Radiation Hardening: No; RoHS Compliant: Yes; ComponentLink1URL: https://datasheet.ciiva.com/15126/getdatasheetpartid-650790-15126713.pdf?src-supplier=Verical; ComponentLink1Description: https://datasheet.ciiva.com/15126/getdatasheetpartid-650790-15126713.pdf?src-supplier=Verical; Supplier Part Number 1: W25X10CLSNIG-ND
Y2 = ABM10W-25.0000MHZ-8-D1X-T3: CRYSTAL 25.0000MHZ 8PF SMD, 2.5x2mm, RoHS; Manufacturer: Abracon; Frequency Tolerance: 10ppm; Frequency Stability: 20ppm; ESR (Equivalent Series Resistance): 100R; Max Operating Temperature: 85°C; Min Operating Temperature: -40°C; Case/Package: SMD/SMT; Mount: Surface Mount; Load Capacitance: 8pF; Packaging: Tape and Reel; Supplier 1: Digi-Key; Manufacturer Part Number: ABM10W-25.0000MHZ-8-D1X-T3; RoHS: No; Category: Crystals; Stock 1: 4012; Pricing 1: 1=0.73000, 10=0.60600, 50=0.54540, 100=0.48480, 500=0.46056, 1000=0.38784 (USD); Mounting Technology: Surface Mount; ComponentLink1URL: https://abracon.com/Resonators/ABM10W.pdf?src-supplier=Digi-Key; ComponentLink1Description: https://abracon.com/Resonators/ABM10W.pdf?src-supplier=Digi-Key; Supplier Part Number 1: 535-13735-1-ND

## Sheet 05_HDMI_to_DP.SchDoc: HDMI to DisplayPort
size A2; Organization: Greenfield Tech Solutions; Address1: Molendreef 33; Address2: Ossendrecht; Address3: 4641CS; Address4: The Netherlands; Revision: 1.1; SheetNumber: 5; SheetTotal: 11
Used 2 times, as channels HDMI_to_DP_0, HDMI_to_DP_1. Parts and nets are listed once, with the designators drawn on the sheet.
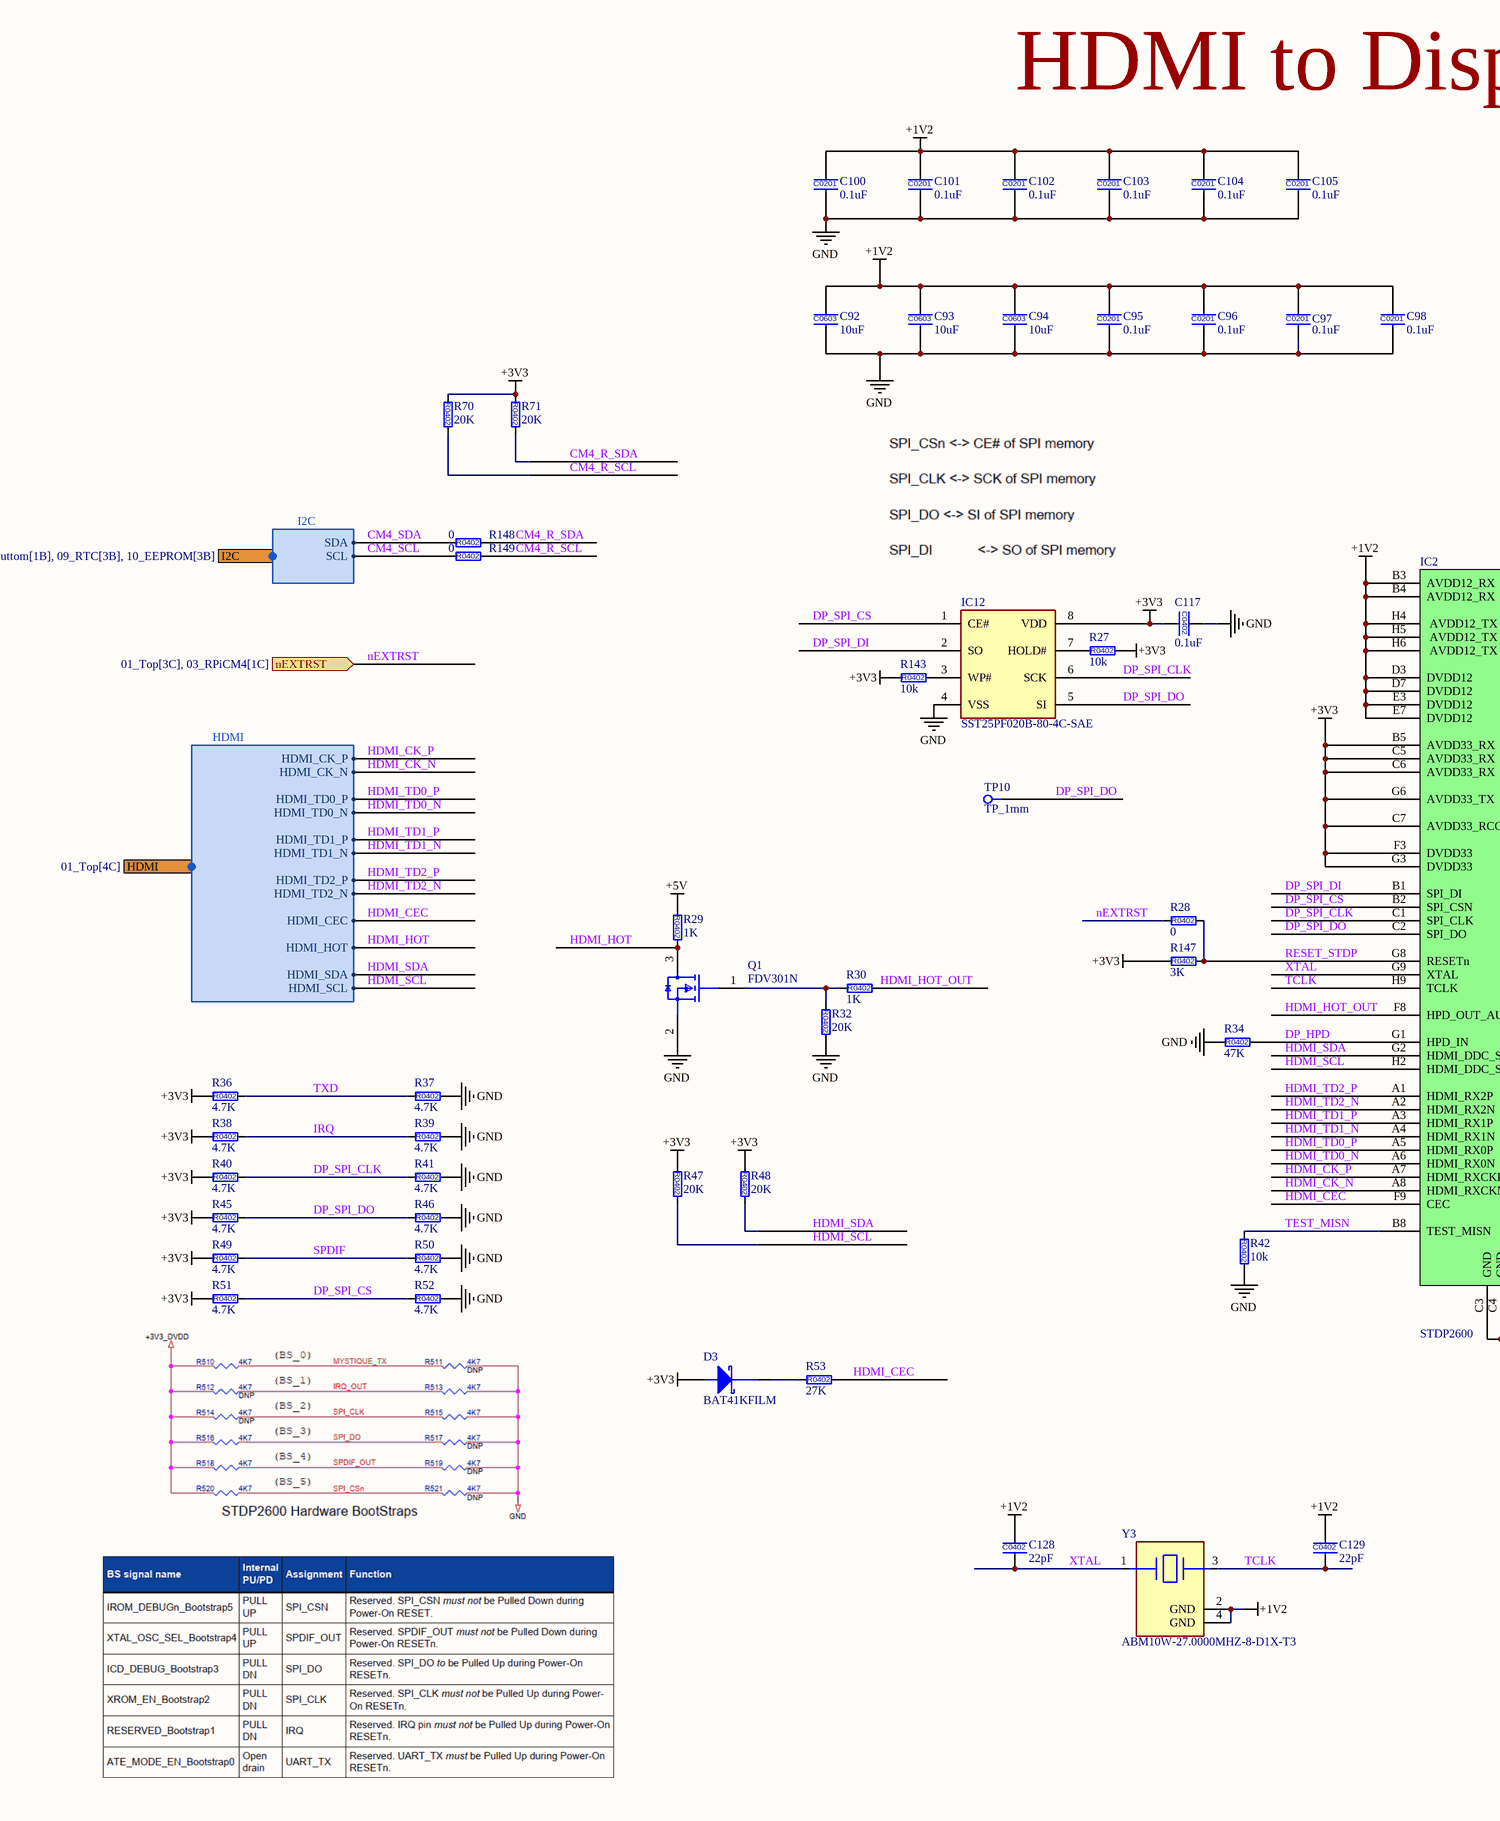
[diagram p10: 05_HDMI_to_DP.SchDoc, left]
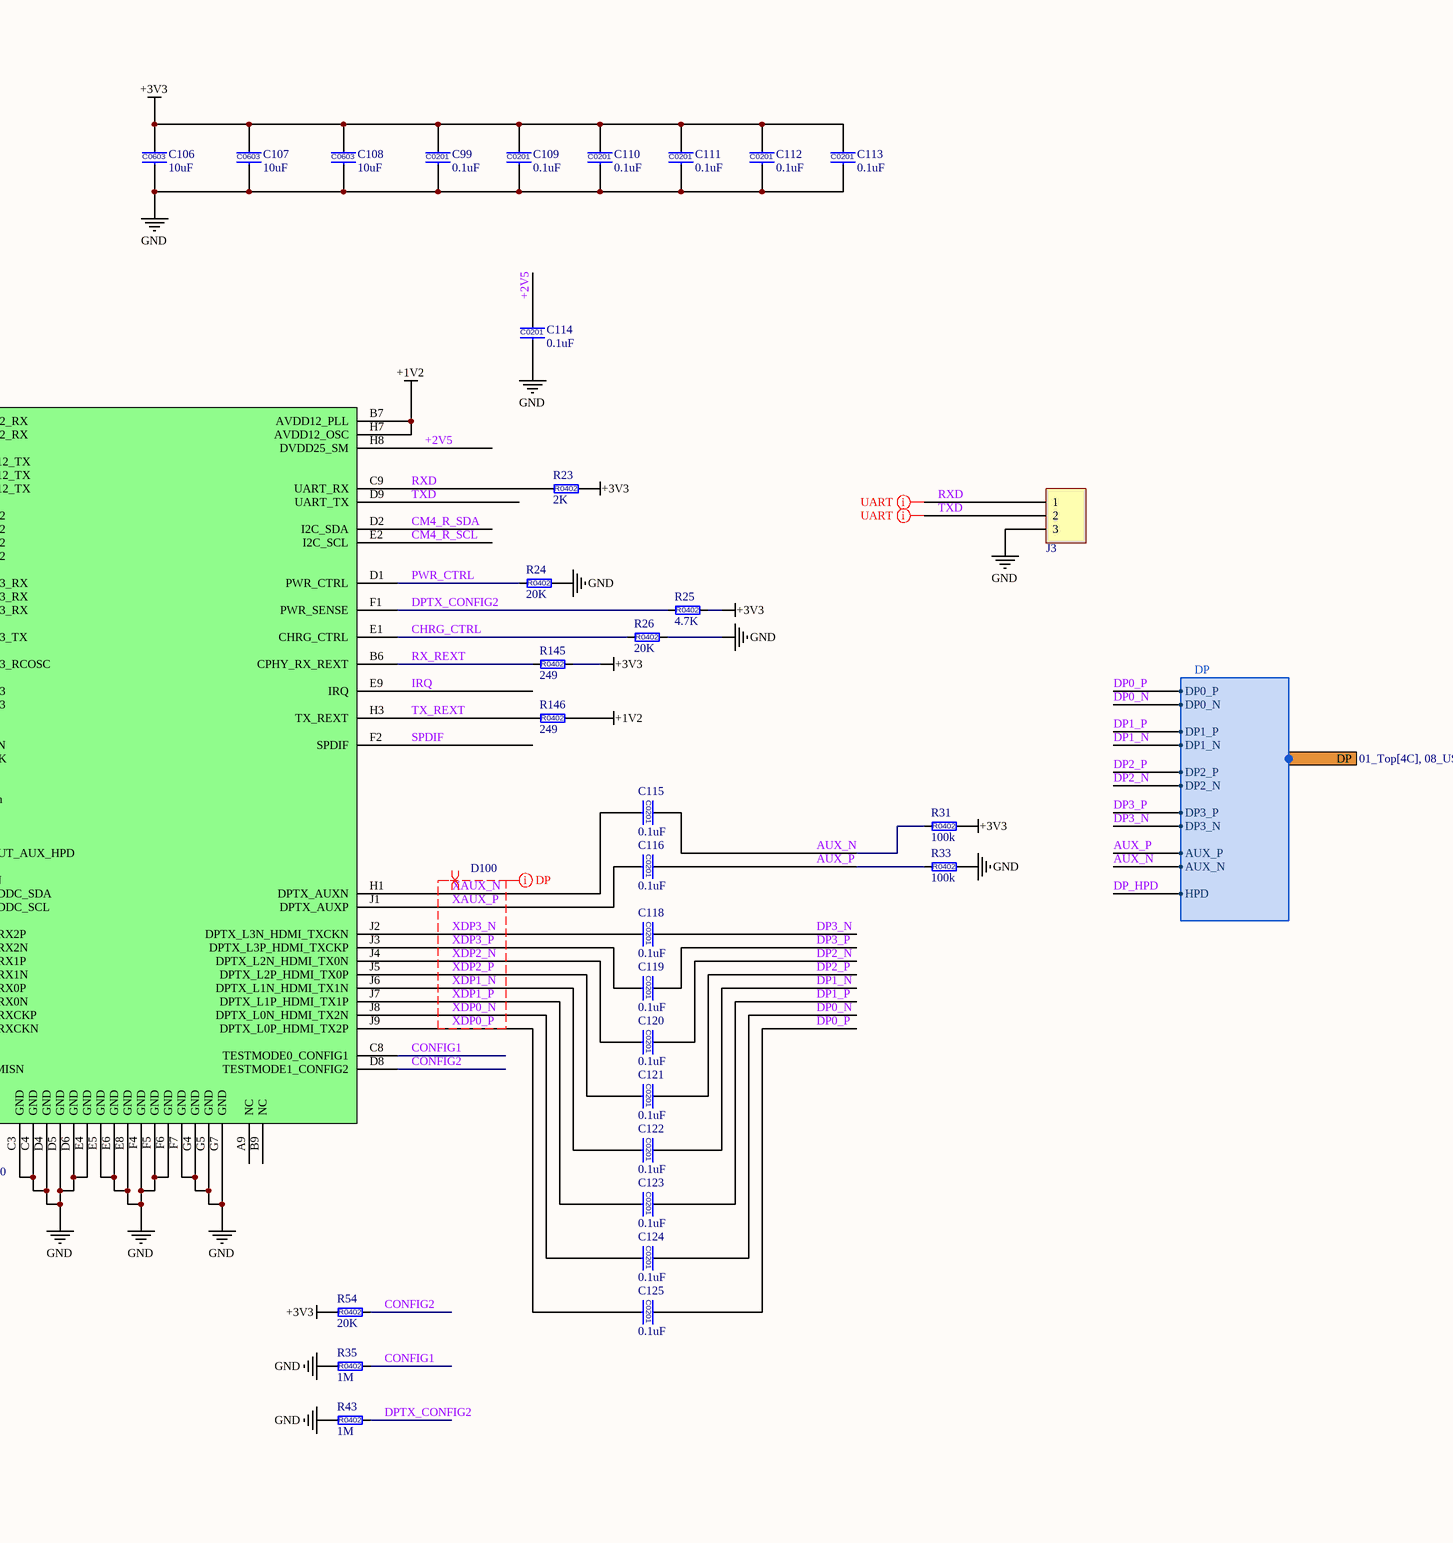
[diagram p11: 05_HDMI_to_DP.SchDoc, right]

### Parts
C92  10uF  [C0603]
C93  10uF  [C0603]
C94  10uF  [C0603]
C95  0.1uF  [C0201]
C96  0.1uF  [C0201]
C97  0.1uF  [C0201]
C98  0.1uF  [C0201]
C99  0.1uF  [C0201]
C100  0.1uF  [C0201]
C101  0.1uF  [C0201]
C102  0.1uF  [C0201]
C103  0.1uF  [C0201]
C104  0.1uF  [C0201]
C105  0.1uF  [C0201]
C106  10uF  [C0603]
C107  10uF  [C0603]
C108  10uF  [C0603]
C109  0.1uF  [C0201]
C110  0.1uF  [C0201]
C111  0.1uF  [C0201]
C112  0.1uF  [C0201]
C113  0.1uF  [C0201]
C114  0.1uF  [C0201]
C115  0.1uF  [C0201]
C116  0.1uF  [C0201]
C117  0.1uF  [C0402]
C118  0.1uF  [C0201]
C119  0.1uF  [C0201]
C120  0.1uF  [C0201]
C121  0.1uF  [C0201]
C122  0.1uF  [C0201]
C123  0.1uF  [C0201]
C124  0.1uF  [C0201]
C125  0.1uF  [C0201]
C128  22pF  [C0402]
C129  22pF  [C0402]
D3  BAT41KFILM  [BAT41KFILM_SOD-523-2]
IC2  STDP2600  [STDP2600_BGA-81]
IC12  SST25PF020B-80-4C-SAE  [SST25PF020B-80-4C-SAE_SOIC_8]
J3  PLS-3  [PLS-3-3D]  (value not drawn)
Q1  FDV301N  [FDV301N_SOT_23]
R23  2K  [R0402]
R24  20K  [R0402]
R25  4.7K  [R0402]
R26  20K  [R0402]
R27  10k  [R0402]
R28  0  [R0402]
R29  1K  [R0402]
R30  1K  [R0402]
R31  100k  [R0402]
R32  20K  [R0402]
R33  100k  [R0402]
R34  47K  [R0402]
R35  1M  [R0402]
R36  4.7K  [R0402]
R37  4.7K  [R0402]
R38  4.7K  [R0402]
R39  4.7K  [R0402]
R40  4.7K  [R0402]
R41  4.7K  [R0402]
R42  10k  [R0402]
R43  1M  [R0402]
R45  4.7K  [R0402]
R46  4.7K  [R0402]
R47  20K  [R0402]
R48  20K  [R0402]
R49  4.7K  [R0402]
R50  4.7K  [R0402]
R51  4.7K  [R0402]
R52  4.7K  [R0402]
R53  27K  [R0402]
R54  20K  [R0402]
R70  20K  [R0402]
R71  20K  [R0402]
R143  10k  [R0402]
R145  249  [R0402]
R146  249  [R0402]
R147  3K  [R0402]
R148  0  [R0402]
R149  0  [R0402]
TP10  TP_1mm  [TP_1MM]  (no BOM)
Y3  ABM10W-27.0000MHZ-8-D1X-T3  [ABM10W]

### Ports
DP (harness DP, see 01_Top[4C], 08_USB_Type-C_DFP_DP_ALT_buttom[1A]), HDMI (harness HDMI, see 01_Top[4C]), I2C (harness I2C, see 01_Top[3C], 03_RPiCM4[1B], 06_USB_Type-C_DFP[1B], 07_USB_Type-C_DFP_DP_ALT[1B], 08_USB_Type-C_DFP_DP_ALT_buttom[1B], 09_RTC[3B], 10_EEPROM[3B]), nEXTRST (in, see 01_Top[3C], 03_RPiCM4[1C])

### Harnesses
DP: DP0_P, DP1_P, DP1_N, DP0_N, DP3_P, DP3_N, DP2_P, DP2_N, AUX_P, AUX_N, HPD
HDMI: HDMI_TD0_P, HDMI_TD1_P, HDMI_TD1_N, HDMI_TD0_N, HDMI_CK_N, HDMI_CK_P, HDMI_TD2_P, HDMI_TD2_N, HDMI_SDA, HDMI_SCL, HDMI_CEC, HDMI_HOT
I2C: SDA, SCL

### Nets
+1V2: C92.1 C93.1 C94.1 C95.1 C96.1 C97.1 C98.1 C100.1 C101.1 C102.1 C103.1 C104.1 C105.1 C128.1 C129.1 IC2.B3(AVDD12_RX) IC2.B4(AVDD12_RX) IC2.B7(AVDD12_PLL) IC2.D3(DVDD12) IC2.D7(DVDD12) IC2.E3(DVDD12) IC2.E7(DVDD12) IC2.H4(AVDD12_TX) IC2.H5(AVDD12_TX) IC2.H6(AVDD12_TX) IC2.H7(AVDD12_OSC) R146.2 Y3.2(GND) Y3.4(GND)
+3V3: C99.1 C106.1 C107.1 C108.1 C109.1 C110.1 C111.1 C112.1 C113.1 C117.2 D3.2(Anode) IC2.B5(AVDD33_RX) IC2.C5(AVDD33_RX) IC2.C6(AVDD33_RX) IC2.C7(AVDD33_RCOSC) IC2.F3(DVDD33) IC2.G3(DVDD33) IC2.G6(AVDD33_TX) IC12.8(VDD) R23.2 R25.2 R27.2 R31.2 R36.1 R38.1 R40.1 R45.1 R47.1 R48.1 R49.1 R51.1 R54.1 R70.1 R71.1 R143.1 R145.2 R147.1
+5V: R29.1
GND: C92.2 C93.2 C94.2 C95.2 C96.2 C97.2 C98.2 C99.2 C100.2 C101.2 C102.2 C103.2 C104.2 C105.2 C106.2 C107.2 C108.2 C109.2 C110.2 C111.2 C112.2 C113.2 C114.2 C117.1 IC2.C3(GND) IC2.C4(GND) IC2.D4(GND) IC2.D5(GND) IC2.D6(GND) IC2.E4(GND) IC2.E5(GND) IC2.E6(GND) IC2.E8(GND) IC2.F4(GND) IC2.F5(GND) IC2.F6(GND) IC2.F7(GND) IC2.G4(GND) IC2.G5(GND) IC2.G7(GND) IC12.4(VSS) J3.3 Q1.2(S) R24.2 R26.2 R32.2 R33.2 R34.1 R35.1 R37.2 R39.2 R41.2 R42.2 R43.1 R46.2 R50.2 R52.2
+2V5: C114.1 IC2.H8(DVDD25_SM)
AUX_N: C115.1 R31.1 ; port DP.AUX_N
AUX_P: C116.1 R33.1 ; port DP.AUX_P
CHRG_CTRL: IC2.E1(CHRG_CTRL) R26.1
CM4_R_SCL: IC2.E2(I2C_SCL) R70.2 R149.2
CM4_R_SDA: IC2.D2(I2C_SDA) R71.2 R148.2
CM4_SCL: R149.1 ; port I2C.SCL
CM4_SDA: R148.1 ; port I2C.SDA
CONFIG1: IC2.C8(TESTMODE0_CONFIG1) R35.2
CONFIG2: IC2.D8(TESTMODE1_CONFIG2) R54.2
DP0_N: C124.1 ; port DP.DP0_N
DP0_P: C125.1 ; port DP.DP0_P
DP1_N: C122.1 ; port DP.DP1_N
DP1_P: C123.1 ; port DP.DP1_P
DP2_N: C120.1 ; port DP.DP2_N
DP2_P: C121.1 ; port DP.DP2_P
DP3_N: C118.1 ; port DP.DP3_N
DP3_P: C119.1 ; port DP.DP3_P
DP_HPD: IC2.G1(HPD_IN) R34.2 ; port DP.HPD
DP_SPI_CLK: IC2.C1(SPI_CLK) IC12.6(SCK) R40.2 R41.1
DP_SPI_CS: IC2.B2(SPI_CSN) IC12.1(CE#) R51.2 R52.1
DP_SPI_DI: IC2.B1(SPI_DI) IC12.2(SO)
DP_SPI_DO: IC2.C2(SPI_DO) IC12.5(SI) R45.2 R46.1 TP10.1
DPTX_CONFIG2: IC2.F1(PWR_SENSE) R25.1 R43.2
HDMI_CEC: IC2.F9(CEC) R53.2 ; port HDMI.HDMI_CEC
HDMI_CK_N: IC2.A8(HDMI_RXCKN) ; port HDMI.HDMI_CK_N
HDMI_CK_P: IC2.A7(HDMI_RXCKP) ; port HDMI.HDMI_CK_P
HDMI_HOT: Q1.3(D) R29.2 ; port HDMI.HDMI_HOT
HDMI_HOT_OUT: IC2.F8(HPD_OUT_AUX_HPD) R30.2
HDMI_SCL: IC2.H2(HDMI_DDC_SCL) R47.2 ; port HDMI.HDMI_SCL
HDMI_SDA: IC2.G2(HDMI_DDC_SDA) R48.2 ; port HDMI.HDMI_SDA
HDMI_TD0_N: IC2.A6(HDMI_RX0N) ; port HDMI.HDMI_TD0_N
HDMI_TD0_P: IC2.A5(HDMI_RX0P) ; port HDMI.HDMI_TD0_P
HDMI_TD1_N: IC2.A4(HDMI_RX1N) ; port HDMI.HDMI_TD1_N
HDMI_TD1_P: IC2.A3(HDMI_RX1P) ; port HDMI.HDMI_TD1_P
HDMI_TD2_N: IC2.A2(HDMI_RX2N) ; port HDMI.HDMI_TD2_N
HDMI_TD2_P: IC2.A1(HDMI_RX2P) ; port HDMI.HDMI_TD2_P
IRQ: IC2.E9(IRQ) R38.2 R39.1
nEXTRST: R28.1 ; port nEXTRST
PWR_CTRL: IC2.D1(PWR_CTRL) R24.1
RESET_STDP: IC2.G8(RESETn) R28.2 R147.2
RX_REXT: IC2.B6(CPHY_RX_REXT) R145.1
RXD: IC2.C9(UART_RX) J3.1 R23.1
SPDIF: IC2.F2(SPDIF) R49.2 R50.1
TCLK: C129.2 IC2.H9(TCLK) Y3.3
TEST_MISN: IC2.B8(TEST_MISN) R42.1
TX_REXT: IC2.H3(TX_REXT) R146.1
TXD: IC2.D9(UART_TX) J3.2 R36.2 R37.1
XAUX_N: C115.2 IC2.H1(DPTX_AUXN)
XAUX_P: C116.2 IC2.J1(DPTX_AUXP)
XDP0_N: C124.2 IC2.J8(DPTX_L0N_HDMI_TX2N)
XDP0_P: C125.2 IC2.J9(DPTX_L0P_HDMI_TX2P)
XDP1_N: C122.2 IC2.J6(DPTX_L1N_HDMI_TX1N)
XDP1_P: C123.2 IC2.J7(DPTX_L1P_HDMI_TX1P)
XDP2_N: C120.2 IC2.J4(DPTX_L2N_HDMI_TX0N)
XDP2_P: C121.2 IC2.J5(DPTX_L2P_HDMI_TX0P)
XDP3_N: C118.2 IC2.J2(DPTX_L3N_HDMI_TXCKN)
XDP3_P: C119.2 IC2.J3(DPTX_L3P_HDMI_TXCKP)
XTAL: C128.2 IC2.G9(XTAL) Y3.1
NetD3_1: D3.1(Cathode) R53.1
NetIC12_3: IC12.3(WP#) R143.2
NetIC12_7: IC12.7(HOLD#) R27.1
NetQ1_1: Q1.1(G) R30.1 R32.1

Not connected (* = marked no-connect by the designer): IC2 A9(NC) B9(NC)

### Channels
HDMI_to_DP_0: designators end in .1; ports nEXTRST=CM4_rstn
HDMI_to_DP_1: designators end in .2; ports nEXTRST=CM4_rstn

### Layout directives
net class UART_STDP2600: RXD_HDMI_to_DP_0, TXD_HDMI_to_DP_0
net class DP: XAUX_N, XAUX_P, XDP0_N, XDP0_P, XDP1_N, XDP1_P, XDP2_N, XDP2_P, XDP3_N, XDP3_P
differential pair; differential pair class D100: XAUX_N, XAUX_P, XDP0_N, XDP0_P, XDP1_N, XDP1_P, XDP2_N, XDP2_P, XDP3_N, XDP3_P

### Notes on the sheet
- HDMI to Display Port
- Title
- Size:
- Date:
- File:
- A2
- Number:
- Time:
- Revision:
- Sheet
- of
- (in symbol 0603ZD106KAT2A) C0603
- (in symbol 02016D104KAT) C0201
- (in symbol 04023A220KAT2A) C0402
- (in symbol 04023D104KAT2A) C0402
- (in symbol CRCW04021K00FK) R0402
- (in symbol CRCW04021M00FKEDC) R0402
- (in symbol CRCW04022K00FKEE) R0402
- (in symbol CRCW04023K00FKED) R0402
- (in symbol CRCW04024K7FK) R0402
- (in symbol CRCW040210K0FK) R0402
- (in symbol CRCW040220K0FK) R0402
- (in symbol CRCW040227K0FK) R0402
- (in symbol CRCW040247K0FK) R0402
- (in symbol CRCW0402100KFK) R0402
- (in symbol CRCW0402249RFKEDC) R0402
- (in symbol CRCW04020000Z0) R0402

### Library data of the parts
C92-C94 C106-C108 = 0603ZD106KAT2A: as C8 on sheet 04_PCIe_VL805; Manufacturer Part Number: 0603ZD106KAT2A; Tolerance: ±10%; Voltage - Rated: 10V; Temperature Coefficient: X5R
C95-C105 C109-C116 C118-C125 = 02016D104KAT: as C82 on sheet 04_PCIe_VL805; Category: Capacitors; Manufacturer Part Number: 02016D104KAT; Operating Temperature: -55°C ~ 85°C; Package / Case: 0201; Value: 0.1uF; Voltage - Rated: 6.3V; Supplier: Digi-Key; Tolerance: ±10%; Temperature Coefficient: X5R; Mounting Type: Surface Mount, MLCC
C117 = 04023D104KAT2A: as C10-C12 on sheet 04_PCIe_VL805; Manufacturer Part Number: 04023D104KAT2A; Value: 0.1uF; Voltage - Rated: 25V; Tolerance: ±10%; Temperature Coefficient: X5R
C128 C129 = 04023A220KAT2A: CAP CER 22pF 10% 25V NP0 0402; Manufacturer: KYOCERA AVX; Manufacturer Part Number: 04023A220KAT2A; Operating Temperature: -55°C ~ 125°C; Package / Case: 0402 (1005 Metric); Value: 22pF; Voltage - Rated: 25V; Tolerance: ±10%; Temperature Coefficient: NP0
D3 = BAT41KFILM: DIODE SCHOTTKY 100V 200MA SOD523; Manufacturer: STMicroelectronics; Max Junction Temp: +150°C; Max Surge Forward Current: 1A; Capacitance: 3pF; Peak Reverse Current: 0.1uA; Value: 3pF; Automotive: No; Max Repetitive Reverse Voltage: 100V; Octopart: https://octopart.com/bat41kfilm-stmicroelectronics-658186; Temperature Range High: +150°C; Digikey Description: DIODE SCHOTTKY 100V 200MA SOD523; Device Class L2: Diodes; Forward Current: 200mA; Device Class L1: Discrete Semiconductors; Lead Free: Yes; Temperature: to +150°C; Manufacturer Part Number: BAT41KFILM; Mouser Description: Schottky Diodes & Rectifiers schottky diode; Height: 0.7mm; RoHS: TRUE; ComponentLink2Description: Datasheet; Device Class L3: Schottky Diodes; Category: Diode; Package: SOD-523; ComponentLink2URL: https://www.st.com/resource/en/datasheet/bat41.pdf
IC2 = STDP2600: Advanced HDMI to DisplayPort converter; Part Number: IC0077; Manufacturer: Kinetic Technologies; Manufacturer Part Number: STDP2600ADT; ID: 77; ManfactPart: STDP2600; Supplier 1: Digi-Key; RoHS: No; Category: Interface ICs; Stock 1: 8132; Pricing 1: 1=8.94000, 10=8.04900, 25=7.58240, 50=7.38820, 100=7.19370, 250=6.41604, 500=6.02718, 1000=5.32724 (USD); Supplier Part Number 1: 1654-STDP2600ADTCT-ND; RefVal: STDP2600
IC12 = SST25PF020B-80-4C-SAE: 150 mils SOIC 2.3-3.6V 2 Mbit SPI Flash 8 SOIC 3.90mm(.150in) TUBE RoHS Compliant: Yes; Manufacturer_Name: Microchip; Address Bus Width: 1b; Interface: SPI,Serial; Min Supply Voltage: 2.3V; Max Supply Voltage: 3.6V; Nominal Supply Current: 30mA; Density: 2Mb; Access Time: 12ns; Memory Type: NOR,Non-Volatile,FLASH; Frequency: 80MHz; Max Supply Current: 15mA; Data Bus Width: 8b; Datasheet Link: https://componentsearchengine.com/Datasheets/3/SST25PF020B-80-4C-SAE.pdf; Height: 1.75mm; Manufacturer_Part_Number: SST25PF020B-80-4C-SAE; Mouser Part Number: 579-020B-80-4C-SAE; Mouser Price/Stock: https://www.mouser.com/Search/Refine.aspx?Keyword=579-020B-80-4C-SAE; Arrow Part Number: SST25PF020B-80-4C-SAE; Arrow Price/Stock: https://www.arrow.com/en/products/sst25pf020b-80-4c-sae/microchip-technology?region=europe; Supplier 1: Digi-Key; Manufacturer: Microchip; Manufacturer Part Number: SST25PF020B-80-4C-SAE; RoHS: Yes; Category: Flash; Stock 1: 289; Pricing 1: 1=1.03000, 25=0.97520, 100=0.94340 (USD); Mount: Surface Mount; Case/Package: SOIC; Number of Pins: 8; Weight: 0.019048oz; Min Operating Temperature: 0°C; Max Operating Temperature: 70°C; Packaging: Rail/Tube; Package Quantity: 100; Memory Size: 2Mb; Max Frequency: 80MHz; Series: SST25; Access Time-Max: 12ns; Supply Current: 30mA; Programming Voltage: 3.6V; Length: 5mm; Width: 4mm; Radiation Hardening: No; RoHS Compliant: Yes; Reach SVHC Compliant: Yes; ComponentLink1URL: https://datasheet.ciiva.com/30477/0900766b8127faed-30477881.pdf?src-supplier=RSComponents; ComponentLink1Description: https://datasheet.ciiva.com/30477/0900766b8127faed-30477881.pdf?src-supplier=RSComponents; ComponentLink2URL: https://datasheet.ciiva.com/26296/sst25pf020b-eng-tds-26296972.pdf?src-supplier=Distrelec; ComponentLink2Description: https://datasheet.ciiva.com/26296/sst25pf020b-eng-tds-26296972.pdf?src-supplier=Distrelec; ComponentLink3URL: https://datasheet.ciiva.com/30020/25135a-30020558.pdf?src-supplier=Avnet; ComponentLink3Description: https://datasheet.ciiva.com/30020/25135a-30020558.pdf?src-supplier=Avnet; ComponentLink4URL: https://datasheet.ciiva.com/15048/20005135b-15048474.pdf?src-supplier=Digi-Key; ComponentLink4Description: https://datasheet.ciiva.com/15048/20005135b-15048474.pdf?src-supplier=Digi-Key; Supplier Part Number 1: SST25PF020B-80-4C-SAE-ND
J3 = PLS-3: Board to Board Connector Straight Header Single Row 3 Position 2.54mm Pitch Through Hole Bag; Manufacturer: Amphenol; Manufacturer Part Number: G800W305018EU; Supplier 1: Mouser; RoHS: Yes; Category: Connectors; Stock 1: 26660; Pricing 1: 1=0.10000, 10=0.04200, 50=0.04200, 100=0.04000, 1000=0.03500, 10000=0.03000 (USD); Supplier Part Number 1: 523-G800W305018EU
Q1 = FDV301N: MOSFET N-CH 25V 220MA SOT-23; Manufacturer: ON Semiconductor; Turn Off Delay Time: 3.5ns; Typ Forward Diode Voltage: 0.8V; Max Junction Temp: +150°C; Threshold Vgs Max: 1.06V; Threshold Vgs Min: 0.7V; Standoff Height: 0.01mm; Max Forward Diode Voltage: 1.2V; Number Of Channels: 1; Rthja Max: 357°C/W; Drain To Source Resistance: 3.1Ω; Input Capacitace At Vds: 9.5pF @ 10V; Gate Charge At Vgs: 0.49nC @ 4.5V; Transconductance: 0.2S; Turn On Delay Time: 3.2ns; Depletion Mode: False; Power Dissipation: 0.35W; Continuous Drain Current: 0.22A; Gate To Source Voltage: 8V; RoHS: TRUE; Lead Free: Yes; Temperature Range High: +150°C; Automotive: No; Height: 1.11mm; Category: Trans; Mouser Description: MOSFET N-Ch Digital; Drain To Source Voltage: 25V; Temperature: -55°C to +150°C; Ipc Land Pattern Name: SOT95P240X100-3; Device Class L1: Discrete Semiconductors; Octopart: https://octopart.com/fdv301n-on+semiconductor-84326713; Footprint Url: https://www.onsemi.com/pub/Collateral/318-08.PDF; Digikey Description: MOSFET N-CH 25V 220MA SOT-23; Drain To Source Breakdown Voltage: 25V; Temperature Range Low: -55°C; Number Of N Channels: 1; Device Class L3: MOSFETs; Package: 318-08; ComponentLink2URL: https://www.onsemi.com/pub/Collateral/FDV301N-D.PDF; Manufacturer Part Number: FDV301N; Device Class L2: Transistors; ComponentLink2Description: Datasheet
R23 = CRCW04022K00FKEE: RES SMD 2K ohm 1% 1/16W R0402; Manufacturer: Vishay; check: ok; Manufacturer Part Number: CRCW04022K00FKEE; Value: 2K; Power (Watts): 1/16W; Package / Case: 0805 (2012 Metric); Tolerance: ±1%
R24 R26 R32 R47 R48 R54 R70 R71 = CRCW040220K0FK: RES SMD 20K ohm 1% 1/16W R0402; Manufacturer: Vishay Dale; Manufacturer Part Number: CRCW040220K0FK; Value: 20K; Power (Watts): 1/16W; Package / Case: 0402; Tolerance: ±1%
R25 R36-R41 R45 R46 R49-R52 = CRCW04024K7FK: RES SMD 4.7K ohm 1% 1/16W R0402; Manufacturer: Vishay Dale; Manufacturer Part Number: CRCW04024K7FK; Value: 4.7K; Power (Watts): 1/16W; Package / Case: 0402; Tolerance: ±1%
R27 R42 R143 = CRCW040210K0FK: as R7 on sheet 04_PCIe_VL805; Manufacturer Part Number: CRCW040210K0FK; Value: 10K; Power (Watts): 1/16W; Package / Case: 0402; Tolerance: ±1%
R28 R148 R149 = CRCW04020000Z0: as R22 on sheet 04_PCIe_VL805; Manufacturer Part Number: CRCW04020000Z0; Value: 0; Power (Watts): 1/16W; Package / Case: 0402
R29 R30 = CRCW04021K00FK: RES SMD 1K ohm 1% 1/16W R0402; Manufacturer: Vishay Dale; Manufacturer Part Number: CRCW04021K00FK; Value: 1K; Power (Watts): 1/16W; Package / Case: 0402; Tolerance: ±1%
R31 R33 = CRCW0402100KFK: RES SMD 100K ohm 1% 1/16W R0402; Manufacturer: Vishay Dale; Manufacturer Part Number: CRCW0402100KFK; Value: 100K; Power (Watts): 1/16W; Package / Case: 0402; Tolerance: ±1%
R34 = CRCW040247K0FK: RES SMD 47K ohm 1% 1/16W R0402; Manufacturer: Vishay Dale; Manufacturer Part Number: CRCW040247K0FK; Value: 47K; Power (Watts): 1/16W; Package / Case: 0402; Tolerance: ±1%
R35 R43 = CRCW04021M00FKEDC: RES SMD 1M ohm 1% 1/16W R0402; Manufacturer: Vishay; check: ok; Manufacturer Part Number: CRCW04021M00FKEDC; Value: 1M; Power (Watts): 1/16W; Package / Case: 0402; Tolerance: ±1%
R53 = CRCW040227K0FK: RES SMD 27K ohm 1% 1/16W R0402; Manufacturer: Vishay Dale; Manufacturer Part Number: CRCW040227K0FK; Value: 27K; Power (Watts): 1/16W; Package / Case: 0402; Tolerance: ±1%
R145 R146 = CRCW0402249RFKEDC: RES SMD 249 ohm 1% 1/16W R0402; Manufacturer: Vishay; check: ok; Manufacturer Part Number: CRCW0402249RFKEDC; Value: 249; Power (Watts): 1/16W; Package / Case: 0402; Tolerance: ±1%
R147 = CRCW04023K00FKED: RES SMD 3K ohm 1% 1/16W R0402; Manufacturer: Vishay; check: ok; Manufacturer Part Number: CRCW04023K00FKED; Value: 3K; Power (Watts): 1/16W; Package / Case: 0402; Tolerance: ±1%
TP10 = TP_1mm: Testpoint 1mm; Manufacturer Part Number: General Test Point
Y3 = ABM10W-27.0000MHZ-8-D1X-T3: CRYSTAL 27.0000MHZ 8PF SMD, 2.5x2mm, RoHS; Manufacturer: Abracon; Supplier 1: Digi-Key; Manufacturer Part Number: ABM10W-27.0000MHZ-8-D1X-T3; RoHS: Yes; Category: Crystals; Stock 1: 1759; Pricing 1: 1=0.73000, 10=0.60600, 50=0.54540, 100=0.48480, 500=0.46056, 1000=0.38784 (USD); Supplier Part Number 1: 535-ABM10W-27.0000MHZ-8-D1X-T3CT-ND; Supplier 2: Digi-Key; Stock 2: 1759; Pricing 2: 1=0.73000, 10=0.60600, 50=0.54540, 100=0.48480, 500=0.46056, 1000=0.38784 (USD); Supplier Part Number 2: 535-ABM10W-27.0000MHZ-8-D1X-T3DKR-ND